# Altium project h616_v1_0.PrjPcb
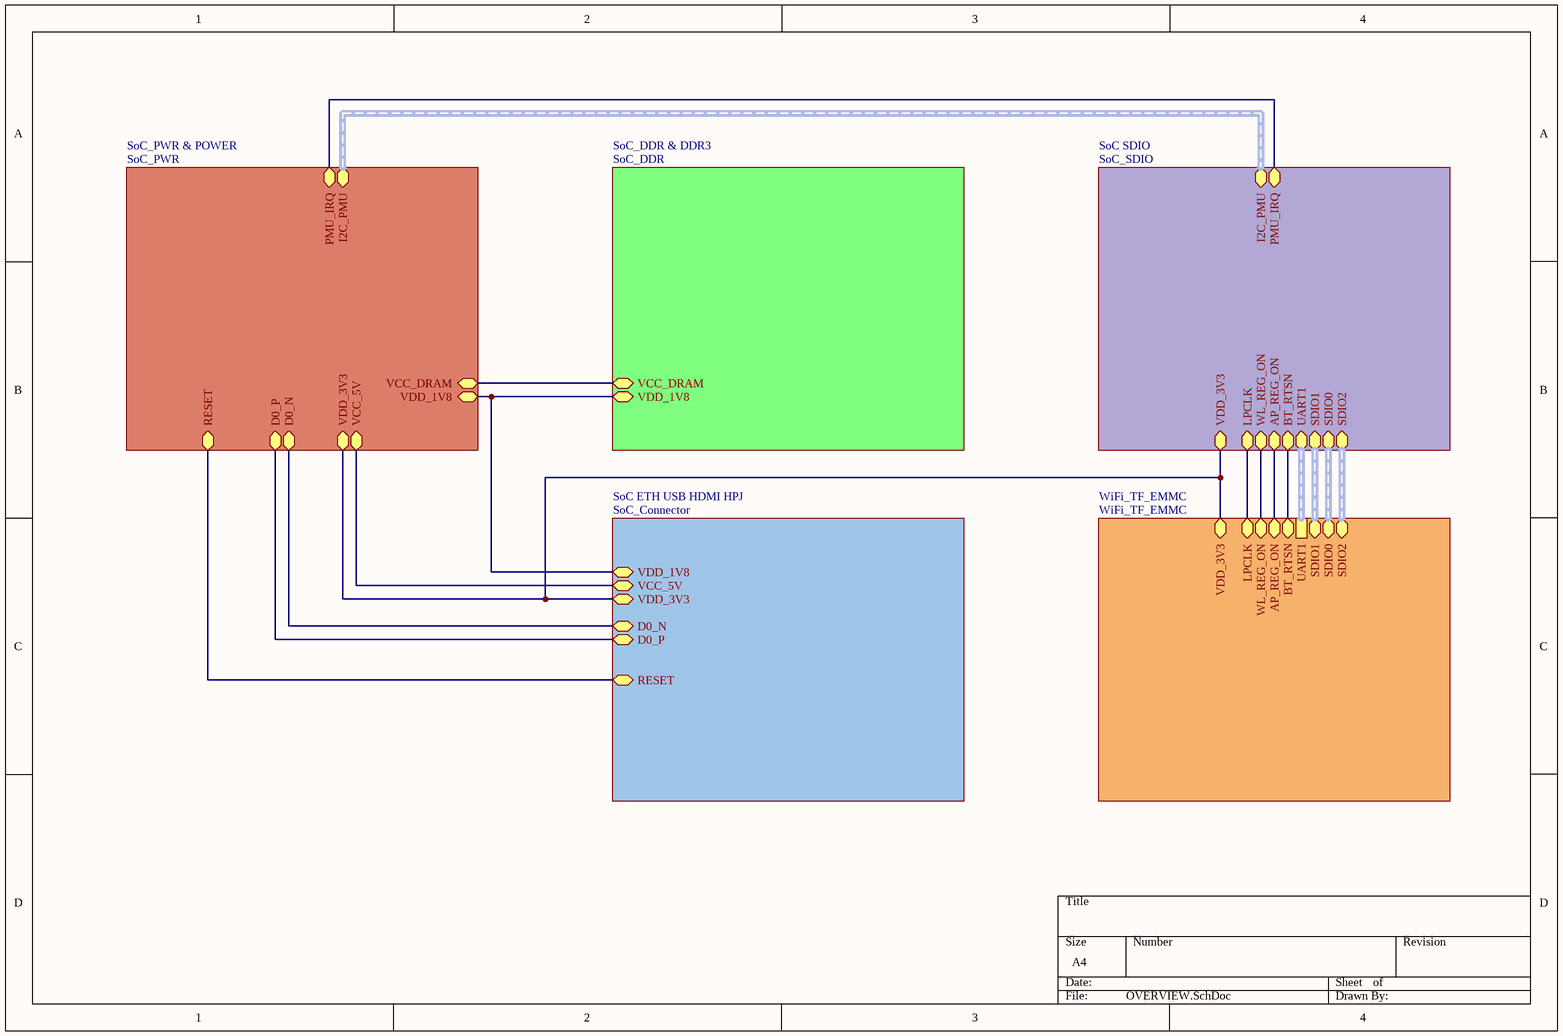
[diagram p0: OVERVIEW.SchDoc]
6 sheets, 145 parts. Net scope: hierarchical (ports join the sheet entries above them; power ports are global).
Board file: H616_PCB.PcbDoc
Sheets:
  OVERVIEW.SchDoc
    SoC_DDR & DDR3 = SoC_DDR.SchDoc
    SoC_PWR & POWER = SoC_PWR.SchDoc
    SoC ETH USB HDMI HPJ = SoC_Connector.SchDoc
    SoC SDIO = SoC_SDIO.SchDoc
    WiFi_TF_EMMC = WiFi_TF_EMMC.SchDoc

## Sheet OVERVIEW.SchDoc
size A4; SheetNumber: 1; SheetTotal: 6

### Sub-sheets
SoC ETH USB HDMI HPJ = SoC_Connector: VCC_5V (bidir), VDD_3V3 (bidir), VDD_1V8 (bidir), D0_N (bidir), D0_P (bidir), RESET (bidir)
SoC SDIO = SoC_SDIO: VDD_3V3 (bidir), LPCLK (bidir), WL_REG_ON (bidir), AP_REG_ON (bidir), BT_RTSN (bidir), UART1 (bidir), SDIO1 (bidir), SDIO0 (bidir), I2C_PMU (bidir), PMU_IRQ (bidir), SDIO2 (bidir)
SoC_DDR & DDR3 = SoC_DDR: VCC_DRAM (bidir), VDD_1V8 (bidir)
SoC_PWR & POWER = SoC_PWR: VCC_DRAM (bidir), VDD_1V8 (bidir), VCC_5V (bidir), VDD_3V3 (bidir), D0_P (bidir), D0_N (bidir), I2C_PMU (bidir), RESET (bidir), PMU_IRQ (bidir)
WiFi_TF_EMMC = WiFi_TF_EMMC: LPCLK (bidir), WL_REG_ON (bidir), AP_REG_ON (bidir), BT_RTSN (bidir), UART1, SDIO1 (bidir), VDD_3V3 (bidir), SDIO0 (bidir), SDIO2 (bidir)

### Nets
VCC_5V: sheet SoC_PWR & POWER/VCC_5V, sheet SoC ETH USB HDMI HPJ/VCC_5V
VCC_DRAM: sheet SoC_DDR & DDR3/VCC_DRAM, sheet SoC_PWR & POWER/VCC_DRAM
VDD_1V8: sheet SoC_DDR & DDR3/VDD_1V8, sheet SoC_PWR & POWER/VDD_1V8, sheet SoC ETH USB HDMI HPJ/VDD_1V8
VDD_3V3: sheet SoC_PWR & POWER/VDD_3V3, sheet SoC ETH USB HDMI HPJ/VDD_3V3, sheet SoC SDIO/VDD_3V3, sheet WiFi_TF_EMMC/VDD_3V3
AP_REG_ON: sheet SoC SDIO/AP_REG_ON, sheet WiFi_TF_EMMC/AP_REG_ON
BT_RTSN: sheet SoC SDIO/BT_RTSN, sheet WiFi_TF_EMMC/BT_RTSN
D0_N: sheet SoC_PWR & POWER/D0_N, sheet SoC ETH USB HDMI HPJ/D0_N
D0_P: sheet SoC_PWR & POWER/D0_P, sheet SoC ETH USB HDMI HPJ/D0_P
LPCLK: sheet SoC SDIO/LPCLK, sheet WiFi_TF_EMMC/LPCLK
PMU_IRQ: sheet SoC_PWR & POWER/PMU_IRQ, sheet SoC SDIO/PMU_IRQ
RESET: sheet SoC_PWR & POWER/RESET, sheet SoC ETH USB HDMI HPJ/RESET
WL_REG_ON: sheet SoC SDIO/WL_REG_ON, sheet WiFi_TF_EMMC/WL_REG_ON

### Buses and harness runs
harness sheet SoC SDIO/I2C_PMU = sheet SoC_PWR & POWER/I2C_PMU
harness sheet SoC SDIO/SDIO0 = sheet WiFi_TF_EMMC/SDIO0
harness sheet SoC SDIO/SDIO1 = sheet WiFi_TF_EMMC/SDIO1
harness sheet SoC SDIO/SDIO2 = sheet WiFi_TF_EMMC/SDIO2
harness sheet SoC SDIO/UART1 = sheet WiFi_TF_EMMC/UART1

## Sheet SoC_DDR.SchDoc
size A3; SheetNumber: 2; SheetTotal: 6
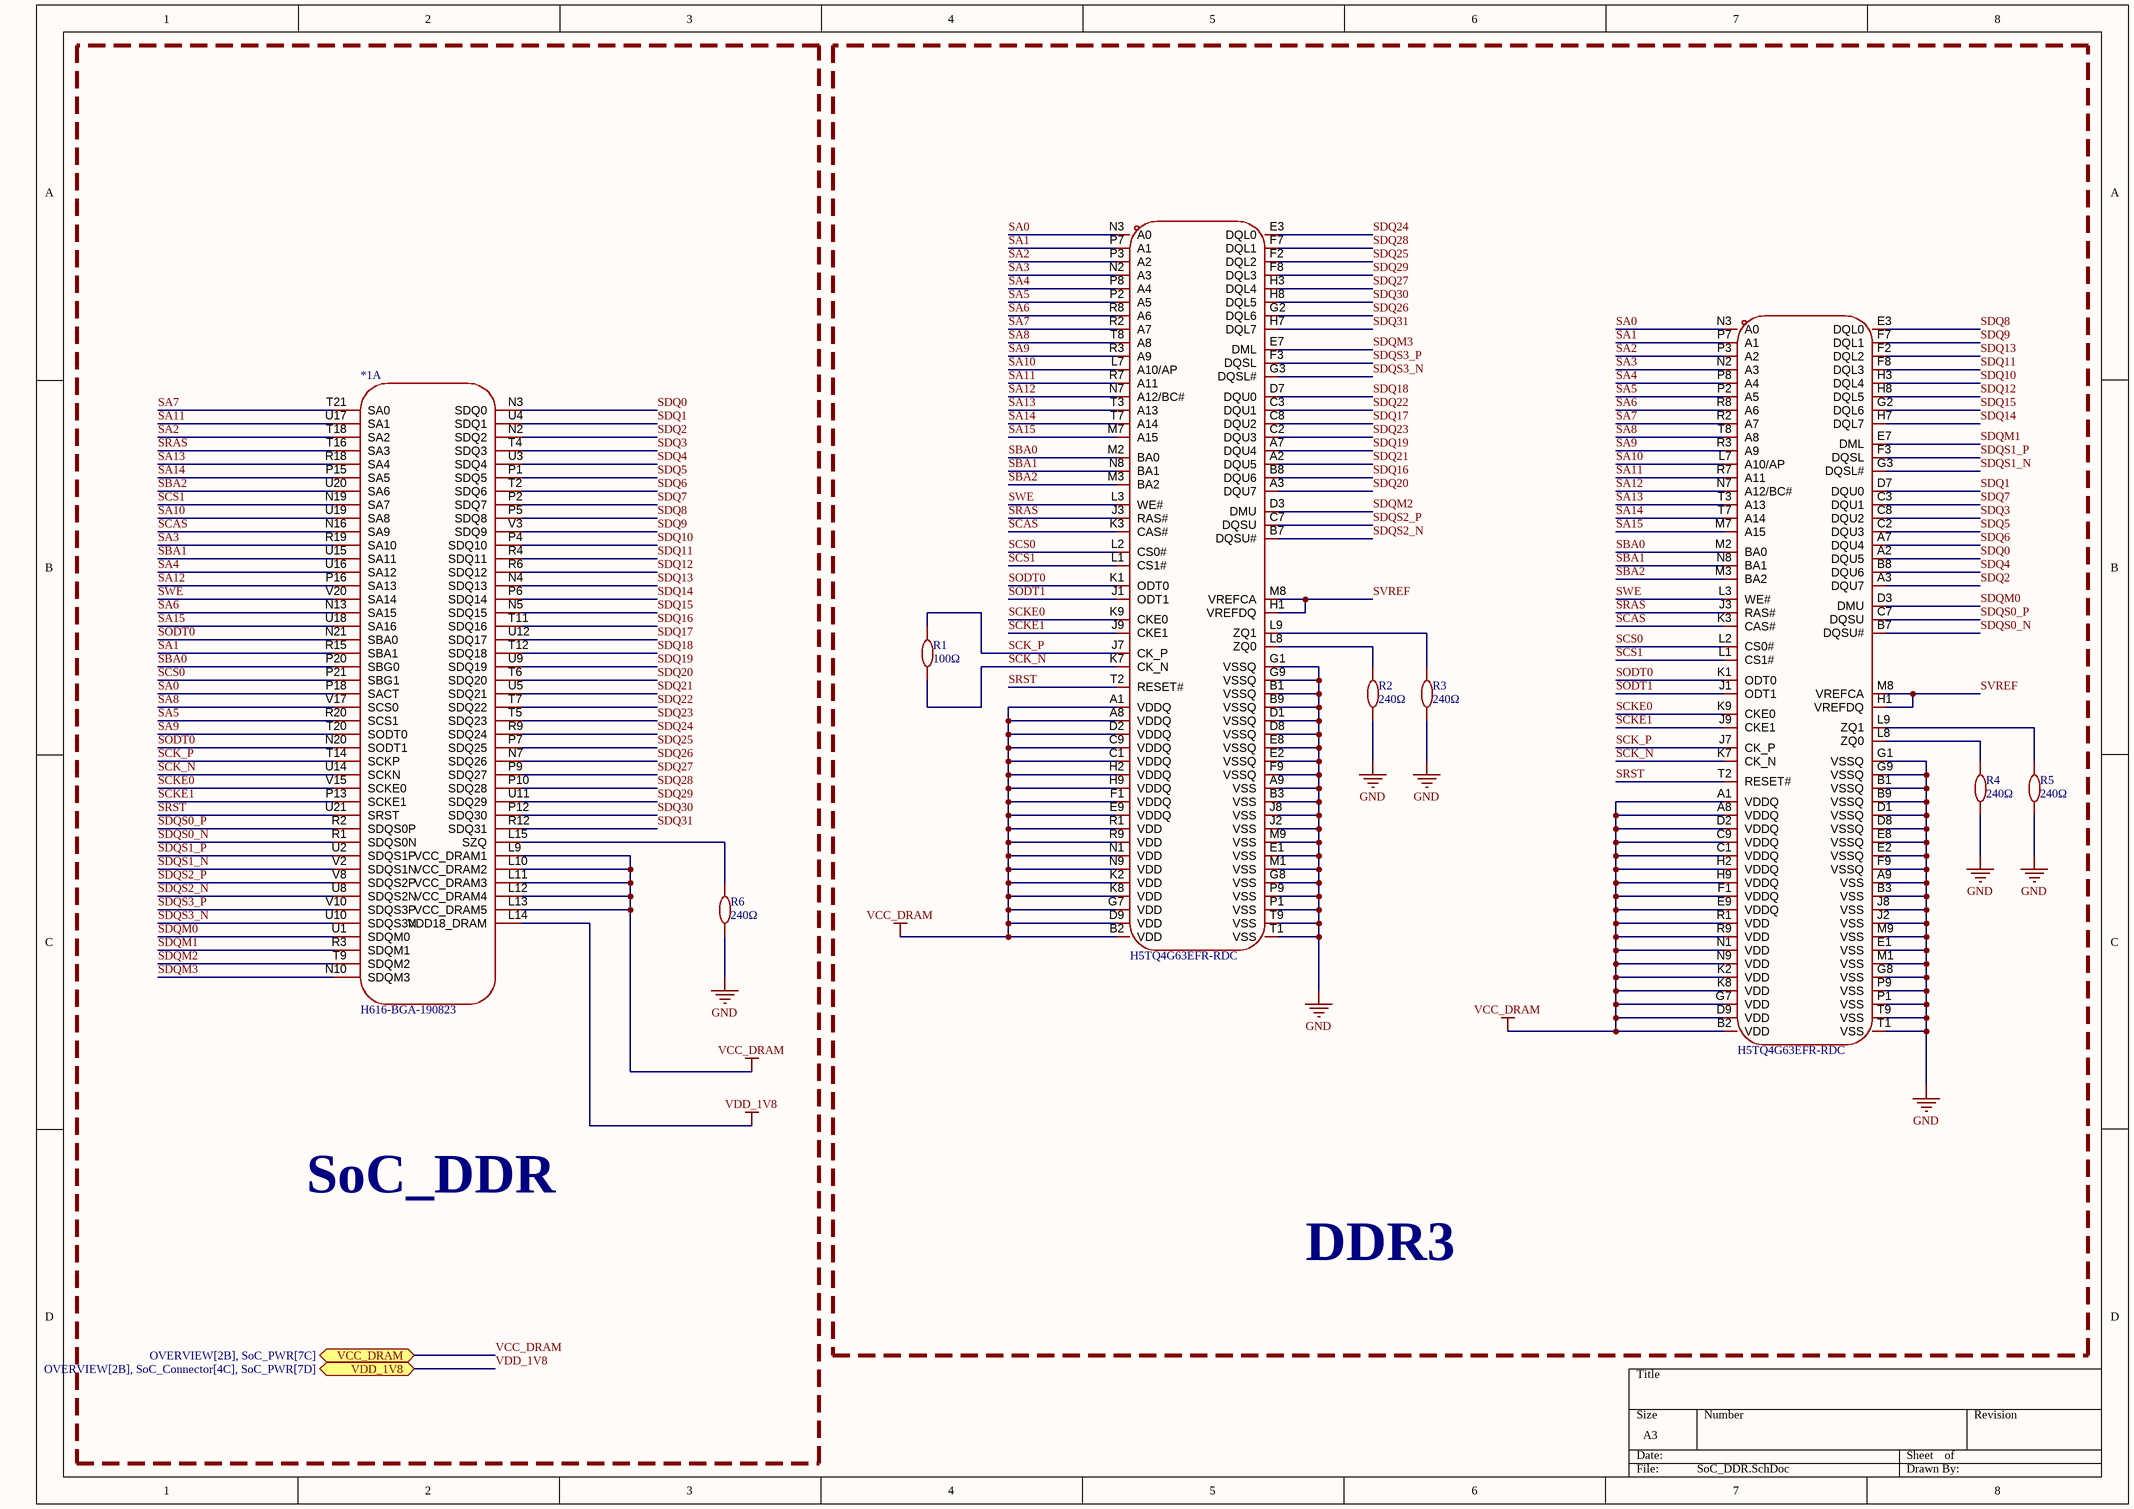
[diagram p1: SoC_DDR.SchDoc]

### Parts
*1  H616-BGA-190823  [BGA-284_L14.0-W12.0-P0.65-TL]  (part A of 4)
R1  100Ω  [R0402]
R2  240Ω  [R0402]
R3  240Ω  [R0402]
R4  240Ω  [R0402]
R5  240Ω  [R0402]
R6  240Ω  [R0402]
U1  H5TQ4G63EFR-RDC  [TFBGA-96_L13.0-W7.5-R16-C6-P0.80-TL]
U2  H5TQ4G63EFR-RDC  [TFBGA-96_L13.0-W7.5-R16-C6-P0.80-TL]

### Blocks framed on the sheet
SoC_DDR: *1 R6
DDR3: R1-R5 U1 U2

### Ports
VCC_DRAM (bidir, see OVERVIEW[2B], SoC_PWR[7C]), VDD_1V8 (bidir, see OVERVIEW[2B], SoC_Connector[4C], SoC_PWR[7D])

### Nets
GND: R2.1 R3.1 R4.1 R5.1 R6.1 U1.A9(VSS) U1.B1(VSSQ) U1.B3(VSS) U1.B9(VSSQ) U1.D1(VSSQ) U1.D8(VSSQ) U1.E1(VSS) U1.E2(VSSQ) U1.E8(VSSQ) U1.F9(VSSQ) U1.G1(VSSQ) U1.G8(VSS) U1.G9(VSSQ) U1.J2(VSS) U1.J8(VSS) U1.M1(VSS) U1.M9(VSS) U1.P1(VSS) U1.P9(VSS) U1.T1(VSS) U1.T9(VSS) U2.A9(VSS) U2.B1(VSSQ) U2.B3(VSS) U2.B9(VSSQ) U2.D1(VSSQ) U2.D8(VSSQ) U2.E1(VSS) U2.E2(VSSQ) U2.E8(VSSQ) U2.F9(VSSQ) U2.G1(VSSQ) U2.G8(VSS) U2.G9(VSSQ) U2.J2(VSS) U2.J8(VSS) U2.M1(VSS) U2.M9(VSS) U2.P1(VSS) U2.P9(VSS) U2.T1(VSS) U2.T9(VSS)
VCC_DRAM: *1.L9(VCC_DRAM1) *1.L10(VCC_DRAM2) *1.L11(VCC_DRAM3) *1.L12(VCC_DRAM4) *1.L13(VCC_DRAM5) U1.A1(VDDQ) U1.A8(VDDQ) U1.B2(VDD) U1.C1(VDDQ) U1.C9(VDDQ) U1.D2(VDDQ) U1.D9(VDD) U1.E9(VDDQ) U1.F1(VDDQ) U1.G7(VDD) U1.H2(VDDQ) U1.H9(VDDQ) U1.K2(VDD) U1.K8(VDD) U1.N1(VDD) U1.N9(VDD) U1.R1(VDD) U1.R9(VDD) U2.A1(VDDQ) U2.A8(VDDQ) U2.B2(VDD) U2.C1(VDDQ) U2.C9(VDDQ) U2.D2(VDDQ) U2.D9(VDD) U2.E9(VDDQ) U2.F1(VDDQ) U2.G7(VDD) U2.H2(VDDQ) U2.H9(VDDQ) U2.K2(VDD) U2.K8(VDD) U2.N1(VDD) U2.N9(VDD) U2.R1(VDD) U2.R9(VDD) ; port VCC_DRAM
VDD_1V8: *1.L14(VDD18_DRAM) ; port VDD_1V8
SA0: *1.P18(SACT) U1.N3(A0) U2.N3(A0)
SA1: *1.R15(SBA1) U1.P7(A1) U2.P7(A1)
SA2: *1.T18(SA2) U1.P3(A2) U2.P3(A2)
SA3: *1.R19(SA10) U1.N2(A3) U2.N2(A3)
SA4: *1.U16(SA12) U1.P8(A4) U2.P8(A4)
SA5: *1.R20(SCS1) U1.P2(A5) U2.P2(A5)
SA6: *1.N13(SA15) U1.R8(A6) U2.R8(A6)
SA7: *1.T21(SA0) U1.R2(A7) U2.R2(A7)
SA8: *1.V17(SCS0) U1.T8(A8) U2.T8(A8)
SA9: *1.T20(SODT0) U1.R3(A9) U2.R3(A9)
SA10: *1.U19(SA8) U1.L7(A10/AP) U2.L7(A10/AP)
SA11: *1.U17(SA1) U1.R7(A11) U2.R7(A11)
SA12: *1.P16(SA13) U1.N7(A12/BC#) U2.N7(A12/BC#)
SA13: *1.R18(SA4) U1.T3(A13) U2.T3(A13)
SA14: *1.P15(SA5) U1.T7(A14) U2.T7(A14)
SA15: *1.U18(SA16) U1.M7(A15) U2.M7(A15)
SBA0: *1.P20(SBG0) U1.M2(BA0) U2.M2(BA0)
SBA1: *1.U15(SA11) U1.N8(BA1) U2.N8(BA1)
SBA2: *1.U20(SA6) U1.M3(BA2) U2.M3(BA2)
SCAS: *1.N16(SA9) U1.K3(CAS#) U2.K3(CAS#)
SCK_N: *1.U14(SCKN) R1.1 U1.K7(CK_N) U2.K7(CK_N)
SCK_P: *1.T14(SCKP) R1.2 U1.J7(CK_P) U2.J7(CK_P)
SCKE0: *1.V15(SCKE0) U1.K9(CKE0) U2.K9(CKE0)
SCKE1: *1.P13(SCKE1) U1.J9(CKE1) U2.J9(CKE1)
SCS0: *1.P21(SBG1) U1.L2(CS0#) U2.L2(CS0#)
SCS1: *1.N19(SA7) U1.L1(CS1#) U2.L1(CS1#)
SDQ0: *1.N3(SDQ0) U2.A2(DQU5)
SDQ1: *1.U4(SDQ1) U2.D7(DQU0)
SDQ2: *1.N2(SDQ2) U2.A3(DQU7)
SDQ3: *1.T4(SDQ3) U2.C8(DQU2)
SDQ4: *1.U3(SDQ4) U2.B8(DQU6)
SDQ5: *1.P1(SDQ5) U2.C2(DQU3)
SDQ6: *1.T2(SDQ6) U2.A7(DQU4)
SDQ7: *1.P2(SDQ7) U2.C3(DQU1)
SDQ8: *1.P5(SDQ8) U2.E3(DQL0)
SDQ9: *1.V3(SDQ9) U2.F7(DQL1)
SDQ10: *1.P4(SDQ10) U2.H3(DQL4)
SDQ11: *1.R4(SDQ11) U2.F8(DQL3)
SDQ12: *1.R6(SDQ12) U2.H8(DQL5)
SDQ13: *1.N4(SDQ13) U2.F2(DQL2)
SDQ14: *1.P6(SDQ14) U2.H7(DQL7)
SDQ15: *1.N5(SDQ15) U2.G2(DQL6)
SDQ16: *1.T11(SDQ16) U1.B8(DQU6)
SDQ17: *1.U12(SDQ17) U1.C8(DQU2)
SDQ18: *1.T12(SDQ18) U1.D7(DQU0)
SDQ19: *1.U9(SDQ19) U1.A7(DQU4)
SDQ20: *1.T6(SDQ20) U1.A3(DQU7)
SDQ21: *1.U5(SDQ21) U1.A2(DQU5)
SDQ22: *1.T7(SDQ22) U1.C3(DQU1)
SDQ23: *1.T5(SDQ23) U1.C2(DQU3)
SDQ24: *1.R9(SDQ24) U1.E3(DQL0)
SDQ25: *1.P7(SDQ25) U1.F2(DQL2)
SDQ26: *1.N7(SDQ26) U1.G2(DQL6)
SDQ27: *1.P9(SDQ27) U1.H3(DQL4)
SDQ28: *1.P10(SDQ28) U1.F7(DQL1)
SDQ29: *1.U11(SDQ29) U1.F8(DQL3)
SDQ30: *1.P12(SDQ30) U1.H8(DQL5)
SDQ31: *1.R12(SDQ31) U1.H7(DQL7)
SDQM0: *1.U1(SDQM0) U2.D3(DMU)
SDQM1: *1.R3(SDQM1) U2.E7(DML)
SDQM2: *1.T9(SDQM2) U1.D3(DMU)
SDQM3: *1.N10(SDQM3) U1.E7(DML)
SDQS0_N: *1.R1(SDQS0N) U2.B7(DQSU#)
SDQS0_P: *1.R2(SDQS0P) U2.C7(DQSU)
SDQS1_N: *1.V2(SDQS1N) U2.G3(DQSL#)
SDQS1_P: *1.U2(SDQS1P) U2.F3(DQSL)
SDQS2_N: *1.U8(SDQS2N) U1.B7(DQSU#)
SDQS2_P: *1.V8(SDQS2P) U1.C7(DQSU)
SDQS3_N: *1.U10(SDQS3N) U1.G3(DQSL#)
SDQS3_P: *1.V10(SDQS3P) U1.F3(DQSL)
SODT0: *1.N20(SODT1) *1.N21(SBA0) U1.K1(ODT0) U2.K1(ODT0)
SODT1: U1.J1(ODT1) U2.J1(ODT1)
SRAS: *1.T16(SA3) U1.J3(RAS#) U2.J3(RAS#)
SRST: *1.U21(SRST) U1.T2(RESET#) U2.T2(RESET#)
SVREF: U1.H1(VREFDQ) U1.M8(VREFCA) U2.H1(VREFDQ) U2.M8(VREFCA)
SWE: *1.V20(SA14) U1.L3(WE#) U2.L3(WE#)
Net*1_L15: *1.L15(SZQ) R6.2
NetR2_2: R2.2 U1.L8(ZQ0)
NetR3_2: R3.2 U1.L9(ZQ1)
NetR4_2: R4.2 U2.L8(ZQ0)
NetR5_2: R5.2 U2.L9(ZQ1)

### Library data of the parts
*1 = H616-BGA-190823: Allwinner H616; Symbol: H616-BGA-190823
R1 = 100Ω: 100Ω 62.5mW 50V ±100ppm/℃ Thick Film Resistor ±1% 0402 Chip Resistor - Surface Mount ROHS
R2-R6 = 240Ω: 240Ω 62.5mW 50V ±100ppm/℃ Thick Film Resistor ±1% 0402 Chip Resistor - Surface Mount ROHS
U1 U2 = H5TQ4G63EFR-RDC: 4Gb DDR3 同步动态随机存取存储器; Symbol: H5TQ4G63EFR-RDC

## Sheet SoC_PWR.SchDoc
size A3; SheetNumber: 3; SheetTotal: 6
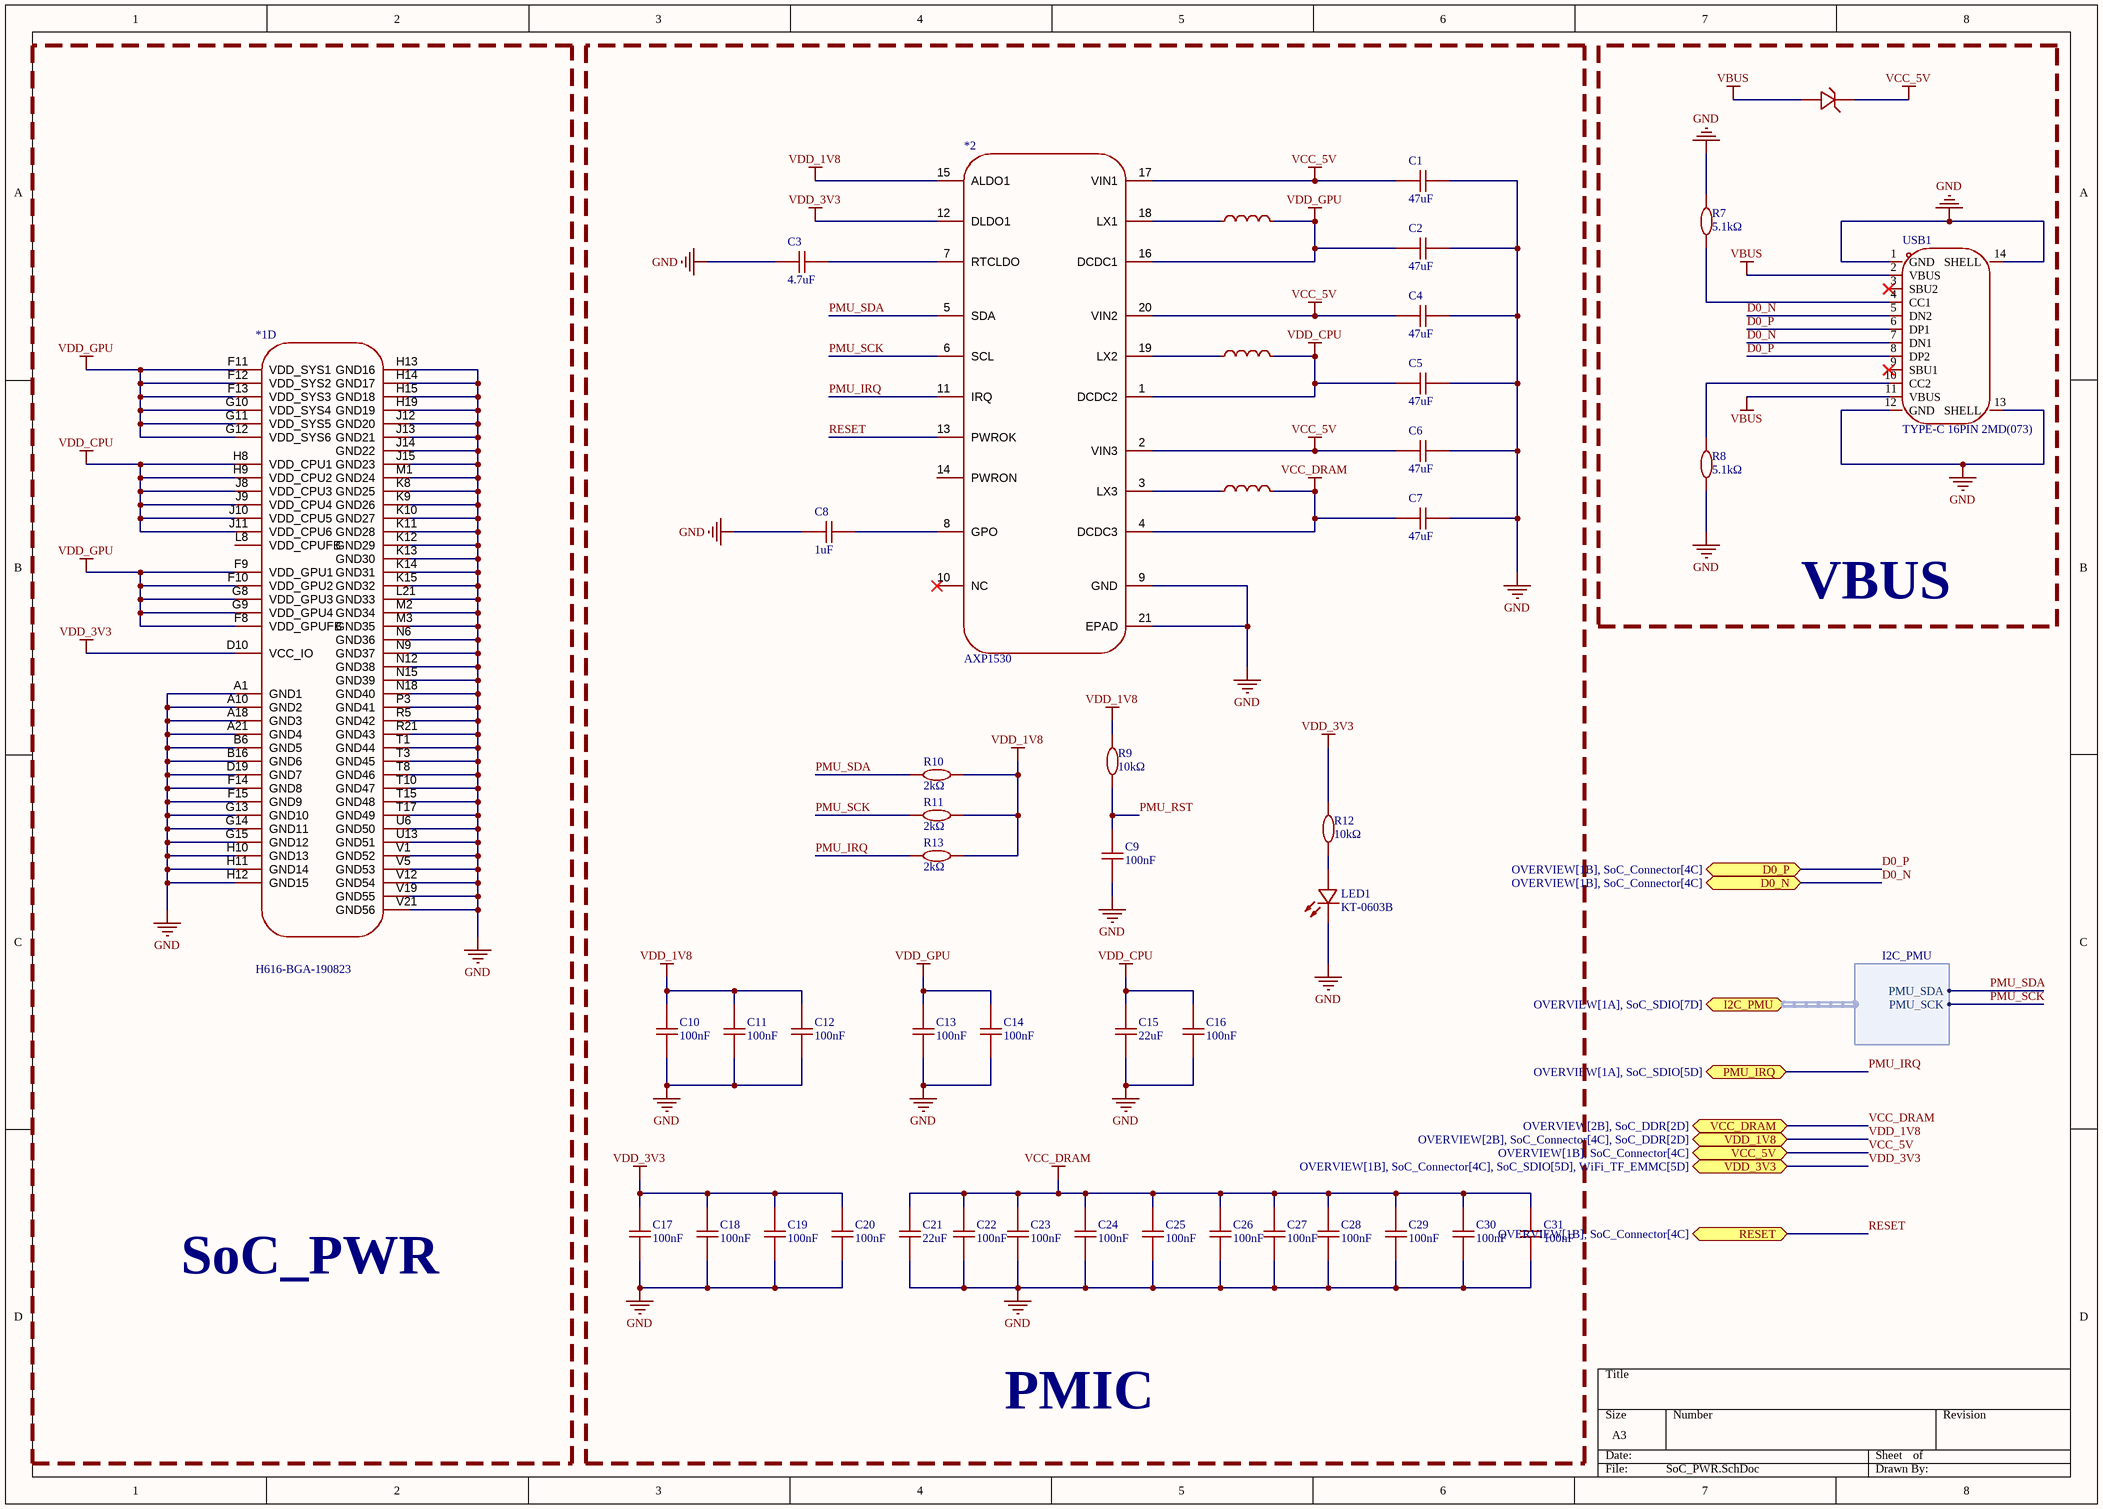
[diagram p2: SoC_PWR.SchDoc]

### Parts
*1  H616-BGA-190823  [BGA-284_L14.0-W12.0-P0.65-TL]  (part D of 4)
*2  AXP1530  [QFN-20_L3.0-W3.0-P0.40-BL-EP1.7]
C1  47uF  [C0603]
C2  47uF  [C0603]
C3  4.7uF  [C0402]
C4  47uF  [C0603]
C5  47uF  [C0603]
C6  47uF  [C0603]
C7  47uF  [C0603]
C8  1uF  [C0402]
C9  100nF  [C0402]
C10  100nF  [C0402]
C11  100nF  [C0402]
C12  100nF  [C0402]
C13  100nF  [C0402]
C14  100nF  [C0402]
C15  22uF  [C0603]
C16  100nF  [C0402]
C17  100nF  [C0402]
C18  100nF  [C0402]
C19  100nF  [C0402]
C20  100nF  [C0402]
C21  22uF  [C0603]
C22  100nF  [C0402]
C23  100nF  [C0402]
C24  100nF  [C0402]
C25  100nF  [C0402]
C26  100nF  [C0402]
C27  100nF  [C0402]
C28  100nF  [C0402]
C29  100nF  [C0402]
C30  100nF  [C0402]
C31  100nF  [C0402]
D1  DSK24  [SOD-123FL_L2.7-W1.8-LS3.8-RD]  (value not drawn)
L1  1uH  [IND-SMD_L4.0-W4.0]  (value not drawn)
L2  1uH  [IND-SMD_L4.0-W4.0]  (value not drawn)
L3  1uH  [IND-SMD_L4.0-W4.0]  (value not drawn)
LED1  KT-0603B  [LED0603-BL]
R7  5.1kΩ  [R0402]
R8  5.1kΩ  [R0402]
R9  10kΩ  [R0402]
R10  2kΩ  [R0402]
R11  2kΩ  [R0402]
R12  10kΩ  [R0402]
R13  2kΩ  [R0402]
USB1  TYPE-C 16PIN 2MD(073)  [USB-C-SMD_TYPE-C-6PIN-2MD-073]

### Blocks framed on the sheet
SoC_PWR: *1
PMIC: *2 C1-C31 L1-L3 LED1 R9-R13
VBUS: D1 R7 R8 USB1

### Ports
D0_N (bidir, see OVERVIEW[1B], SoC_Connector[4C]), D0_P (bidir, see OVERVIEW[1B], SoC_Connector[4C]), I2C_PMU (bidir, harness I2C_PMU, see OVERVIEW[1A], SoC_SDIO[7D]), PMU_IRQ (bidir, see OVERVIEW[1A], SoC_SDIO[5D]), RESET (bidir, see OVERVIEW[1B], SoC_Connector[4C]), VCC_5V (bidir, see OVERVIEW[1B], SoC_Connector[4C]), VCC_DRAM (bidir, see OVERVIEW[2B], SoC_DDR[2D]), VDD_1V8 (bidir, see OVERVIEW[2B], SoC_Connector[4C], SoC_DDR[2D]), VDD_3V3 (bidir, see OVERVIEW[1B], SoC_Connector[4C], SoC_SDIO[5D], WiFi_TF_EMMC[5D])

### Harnesses
I2C_PMU: PMU_SDA, PMU_SCK

### Nets
GND: *1.A1(GND1) *1.A10(GND2) *1.A18(GND3) *1.A21(GND4) *1.B6(GND5) *1.B16(GND6) *1.D19(GND7) *1.F14(GND8) *1.F15(GND9) *1.G13(GND10) *1.G14(GND11) *1.G15(GND12) *1.H10(GND13) *1.H11(GND14) *1.H12(GND15) *1.H13(GND16) *1.H14(GND17) *1.H15(GND18) *1.H19(GND19) *1.J12(GND20) *1.J13(GND21) *1.J14(GND22) *1.J15(GND23) *1.K8(GND25) *1.K9(GND26) *1.K10(GND27) *1.K11(GND28) *1.K12(GND29) *1.K13(GND30) *1.K14(GND31) *1.K15(GND32) *1.L21(GND33) *1.M1(GND24) *1.M2(GND34) *1.M3(GND35) *1.N6(GND36) *1.N9(GND37) *1.N12(GND38) *1.N15(GND39) *1.N18(GND40) *1.P3(GND41) *1.R5(GND42) *1.R21(GND43) *1.T1(GND44) *1.T3(GND45) *1.T8(GND46) *1.T10(GND47) *1.T15(GND48) *1.T17(GND49) *1.U6(GND50) *1.U13(GND51) *1.V1(GND52) *1.V5(GND53) *1.V12(GND54) *1.V19(GND55) *1.V21(GND56) *2.9(GND) *2.21(EPAD) C1.2 C2.2 C3.1 C4.2 C5.2 C6.2 C7.2 C8.1 C9.1 C10.1 C11.1 C12.1 C13.1 C14.1 C15.1 C16.1 C17.1 C18.1 C19.1 C20.1 C21.1 C22.1 C23.1 C24.1 C25.1 C26.1 C27.1 C28.1 C29.1 C30.1 C31.1 LED1.1(K) R7.2 R8.2 USB1.1(GND) USB1.12(GND) USB1.13(SHELL) USB1.14(SHELL)
VBUS: D1.2(A) USB1.2(VBUS) USB1.11(VBUS)
VCC_5V: *2.2(VIN3) *2.17(VIN1) *2.20(VIN2) C1.1 C4.1 C6.1 D1.1(C) ; port VCC_5V
VCC_DRAM: *2.4(DCDC3) C7.1 C21.2 C22.2 C23.2 C24.2 C25.2 C26.2 C27.2 C28.2 C29.2 C30.2 C31.2 L3.2 ; port VCC_DRAM
VDD_1V8: *2.15(ALDO1) C10.2 C11.2 C12.2 R9.2 R10.2 R11.2 R13.2 ; port VDD_1V8
VDD_3V3: *1.D10(VCC_IO) *2.12(DLDO1) C17.2 C18.2 C19.2 C20.2 R12.2 ; port VDD_3V3
VDD_CPU: *1.H8(VDD_CPU1) *1.H9(VDD_CPU2) *1.J8(VDD_CPU3) *1.J9(VDD_CPU4) *1.J10(VDD_CPU5) *1.J11(VDD_CPU6) *2.1(DCDC2) C5.1 C15.2 C16.2 L2.2
VDD_GPU: *1.F8(VDD_GPUFB) *1.F9(VDD_GPU1) *1.F10(VDD_GPU2) *1.F11(VDD_SYS1) *1.F12(VDD_SYS2) *1.F13(VDD_SYS3) *1.G8(VDD_GPU3) *1.G9(VDD_GPU4) *1.G10(VDD_SYS4) *1.G11(VDD_SYS5) *1.G12(VDD_SYS6) *2.16(DCDC1) C2.1 C13.2 C14.2 L1.2
D0_N: USB1.5(DN2) USB1.7(DN1) ; port D0_N
D0_P: USB1.6(DP1) USB1.8(DP2) ; port D0_P
PMU_IRQ: *2.11(IRQ) R13.1 ; port PMU_IRQ
PMU_RST: C9.2 R9.1
PMU_SCK: *2.6(SCL) R11.1 ; port I2C_PMU.PMU_SCK
PMU_SDA: *2.5(SDA) R10.1 ; port I2C_PMU.PMU_SDA
RESET: *2.13(PWROK) ; port RESET
Net*2_3: *2.3(LX3) L3.1
Net*2_7: *2.7(RTCLDO) C3.2
Net*2_8: *2.8(GPO) C8.2
Net*2_18: *2.18(LX1) L1.1
Net*2_19: *2.19(LX2) L2.1
NetLED1_2: LED1.2(A) R12.1
NetR7_1: R7.1 USB1.4(CC1)
NetR8_1: R8.1 USB1.10(CC2)

Not connected (* = marked no-connect by the designer): *1 L8(VDD_CPUFB); *2 10(NC)* 14(PWRON); USB1 3(SBU2)* 9(SBU1)*

### Library data of the parts
*1 = H616-BGA-190823: Allwinner H616; Symbol: H616-BGA-190823
*2 = AXP1530: AXP313A; Symbol: AXP1530
C1 C2 C4-C7 = 47uF: 16V 22uF X5R ±20% 0603 Ceramic Capacitors ROHS
C3 = 4.7uF: 10V 4.7uF X5R ±20% 0402 Ceramic Capacitors ROHS
C8 = 1uF: 50V 1uF X5R ±10% 0402 Ceramic Capacitors ROHS
C9-C14 C16-C20 C22-C31 = 100nF: 50V 100nF X7R ±10% 0402 Ceramic Capacitors ROHS
C15 C21 = 22uF: 16V 22uF X5R ±20% 0603 Ceramic Capacitors ROHS
D1 = DSK24: 电压:40V 电流:2A; Manufacturer: Littelfuse(美国力特); Manufacturer Part: SMAJ5.0A; Symbol: SMAJ5.0A-C83329; Device: SMAJ5.0A_C83329; Add into BOM: yes; Polarity: Unidirectional; Reverse Stand-Off Voltage (Vrwm): 5V; Clamping Voltage: 9.2V; Peak Pulse Current (Ipp): 43.5A; Peak Pulse Power Dissipation (Ppp): 400W; Voltage - Breakdown: 6.4V; Reverse Leakage Current (Ir): 800uA; Type: TVS; LCSC Part Name: 耐压/V 5V-440V 峰值脉冲功率 400W; Supplier Part: C83329; Supplier Footprint: DO-214AC(SMA); JLCPCB Part Class: Extended Part; Datasheet: https://item.szlcsc.com/datasheet/SMAJ5.0A/84493.html; Supplier: LCSC; Convert to PCB: yes; Operating Temperature: -65℃~+150℃
L1-L3 = SLW4030S1R0NST: 4.15A 1uH ±30% 18mΩ SMD,4x4mm Fixed Inductors ROHS; Manufacturer: Sunltech(顺磁); Add into BOM: yes; Symbol: SLW4030S1R0NST; Device: SLW4030S1R0NST; LCSC Part Name: 1uH ±30%; Supplier Part: C206354; Manufacturer Part: SLW4030S1R0NST; Supplier Footprint: SMD,4x4mm; JLCPCB Part Class: Extended Part; Datasheet: https://item.szlcsc.com/datasheet/SLW4030S1R0NST/207399.html; Supplier: LCSC; Convert to PCB: yes; Value: 1uH; Tolerance: ±30%; Current Rating: 4.15A; DC Resistance(DCR): 18mΩ
LED1 = KT-0603B: 30mA 2.6V~3.2V Blue 0603 LED Indication - Discrete ROHS
R7 R8 = 5.1kΩ: 5.1kΩ 62.5mW 50V ±100ppm/℃ Thick Film Resistor ±1% 0402 Chip Resistor - Surface Mount ROHS
R9 R12 = 10kΩ: 62.5mW 10kΩ 50V ±100ppm/℃ Thick Film Resistor ±1% 0402 Chip Resistor - Surface Mount ROHS
R10 R11 R13 = 2kΩ: 100mW 2kΩ 75V ±100ppm/℃ Thick Film Resistor ±1% 0402 Chip Resistor - Surface Mount ROHS
USB1 = TYPE-C 16PIN 2MD(073): 16pin type-c

## Sheet SoC_Connector.SchDoc
size A3; SheetNumber: 4; SheetTotal: 6
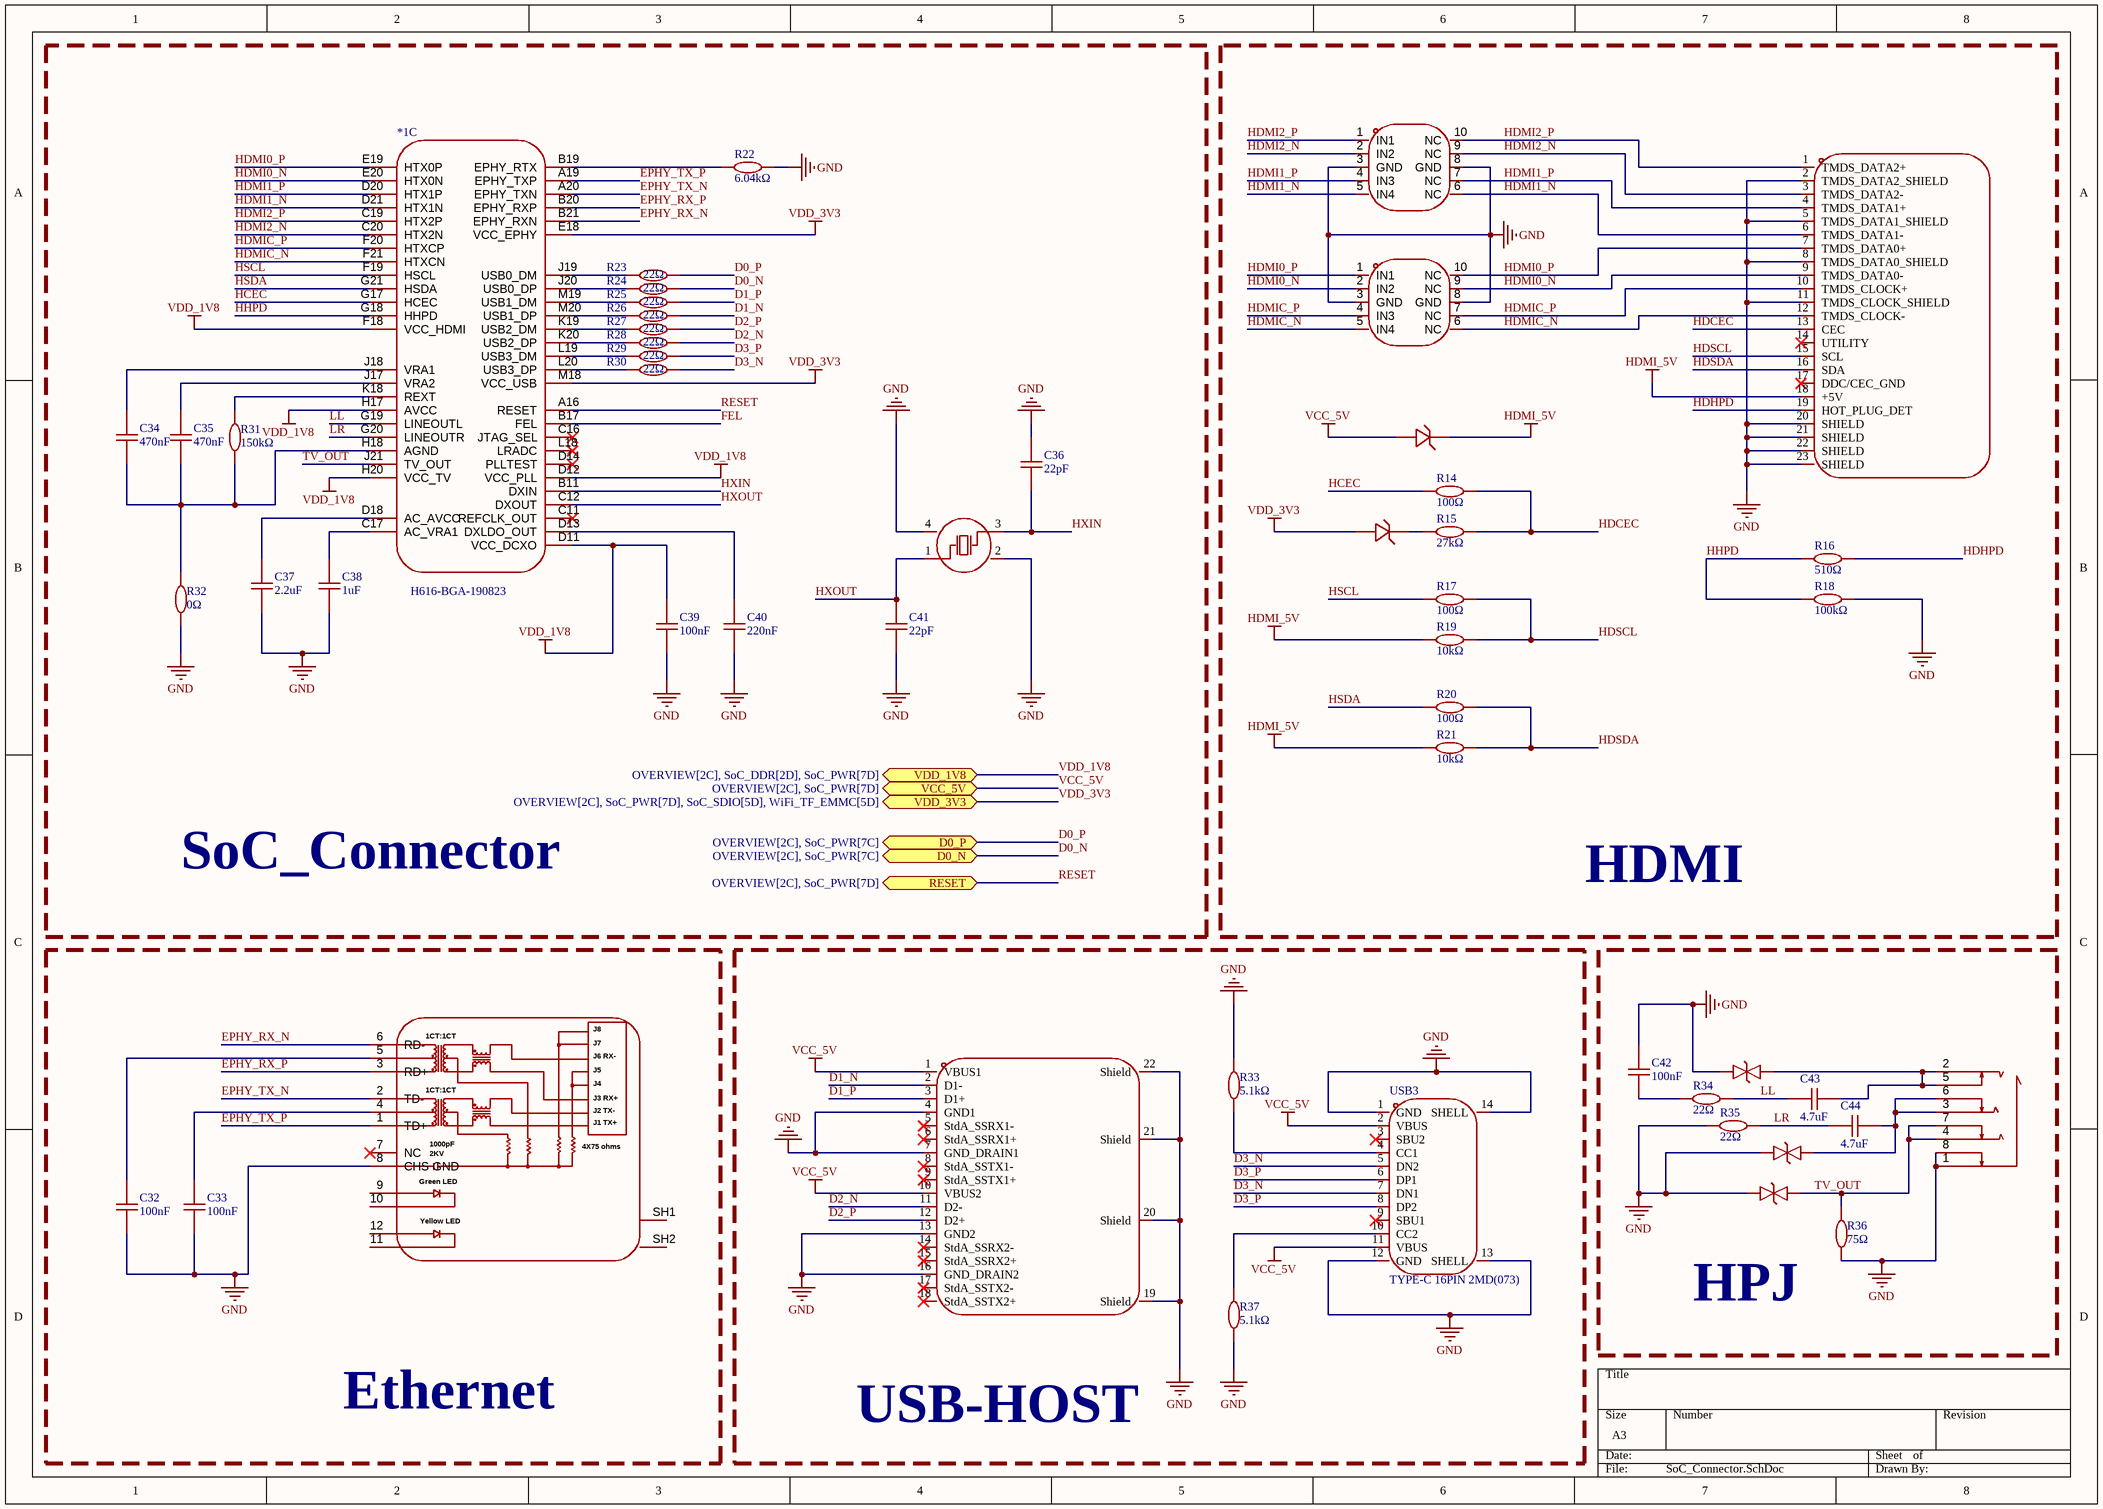
[diagram p3: SoC_Connector.SchDoc]

### Parts
*1  H616-BGA-190823  [BGA-284_L14.0-W12.0-P0.65-TL]  (part C of 4)
AUDIO1  PJ-3930-8A  [AUDIO-TH_PJ-3930-8A]  (value not drawn)
C32  100nF  [C0402]
C33  100nF  [C0402]
C34  470nF  [C0402]
C35  470nF  [C0402]
C36  22pF  [C0402]
C37  2.2uF  [C0402]
C38  1uF  [C0402]
C39  100nF  [C0402]
C40  220nF  [C0402]
C41  22pF  [C0402]
C42  100nF  [C0402]
C43  4.7uF  [C0402]
C44  4.7uF  [C0402]
CN1  KH-HDMI-19P-Cu  [HDMI-SMD_KH-HDMI-19P-CU]  (value not drawn)
D2  RClamp0524PATCT  [SLP2510P8_L2.5-W1.0-P0.50-BL]  (value not drawn)
D3  RClamp0524PATCT  [SLP2510P8_L2.5-W1.0-P0.50-BL]  (value not drawn)
D4  DSK24  [SOD-123FL_L2.7-W1.8-LS3.8-RD]  (value not drawn)
D5  DSK24  [SOD-123FL_L2.7-W1.8-LS3.8-RD]  (value not drawn)
J1  HR911105A_C12074  [RJ45-TH_HR911105A]  (value not drawn)
R14  100Ω  [R0402]
R15  27kΩ  [R0402]
R16  510Ω  [R0402]
R17  100Ω  [R0402]
R18  100kΩ  [R0402]
R19  10kΩ  [R0402]
R20  100Ω  [R0402]
R21  10kΩ  [R0402]
R22  6.04kΩ  [R0402]
R23  22Ω  [R0402]
R24  22Ω  [R0402]
R25  22Ω  [R0402]
R26  22Ω  [R0402]
R27  22Ω  [R0402]
R28  22Ω  [R0402]
R29  22Ω  [R0402]
R30  22Ω  [R0402]
R31  150kΩ  [R0402]
R32  0Ω  [R0402]
R33  5.1kΩ  [R0402]
R34  22Ω  [R0402]
R35  22Ω  [R0402]
R36  75Ω  [R0402]
R37  5.1kΩ  [R0402]
U3  ESD5451N  [DFN1006-2L-BI]  (value not drawn)
U4  ESD5451N  [DFN1006-2L-BI]  (value not drawn)
U5  ESD5451N  [DFN1006-2L-BI]  (value not drawn)
USB2  USB-303WSD-BRY  [USB-A-TH_XUNPU_USB-303WSD-BRY]  (value not drawn)
USB3  TYPE-C 16PIN 2MD(073)  [USB-C-SMD_TYPE-C-6PIN-2MD-073]
X1  24MHz  [CRYSTAL-SMD_4P-L3.2-W2.5-BL]  (value not drawn)

### Blocks framed on the sheet
SoC_Connector: *1 C34-C41 R22-R32 X1
HDMI: CN1 D2-D5 R14-R21
Ethernet: C32 C33 J1
USB-HOST: R33 R37 USB2 USB3
HPJ: AUDIO1 C42-C44 R34-R36 U3-U5

### Ports
D0_N (bidir, see OVERVIEW[2C], SoC_PWR[7C]), D0_P (bidir, see OVERVIEW[2C], SoC_PWR[7C]), RESET (bidir, see OVERVIEW[2C], SoC_PWR[7D]), VCC_5V (bidir, see OVERVIEW[2C], SoC_PWR[7D]), VDD_1V8 (bidir, see OVERVIEW[2C], SoC_DDR[2D], SoC_PWR[7D]), VDD_3V3 (bidir, see OVERVIEW[2C], SoC_PWR[7D], SoC_SDIO[5D], WiFi_TF_EMMC[5D])

### Nets
GND: AUDIO1.1 AUDIO1.8 C32.1 C33.1 C36.2 C37.1 C38.1 C39.1 C40.1 C41.1 C42.2 CN1.2(TMDS_DATA2_SHIELD) CN1.5(TMDS_DATA1_SHIELD) CN1.8(TMDS_DATA0_SHIELD) CN1.11(TMDS_CLOCK_SHIELD) CN1.20(SHIELD) CN1.21(SHIELD) CN1.22(SHIELD) CN1.23(SHIELD) D2.3(GND) D2.8(GND) D3.3(GND) D3.8(GND) J1.8(CHS_GND) R18.2 R22.2 R32.1 R33.2 R35.1 R36.1 R37.2 U3.1 U4.1 U5.1 USB2.4(GND1) USB2.7(GND_DRAIN1) USB2.13(GND2) USB2.16(GND_DRAIN2) USB2.19(Shield) USB2.20(Shield) USB2.21(Shield) USB2.22(Shield) USB3.1(GND) USB3.12(GND) USB3.13(SHELL) USB3.14(SHELL) X1.2(GND) X1.4(GND)
HDMI_5V: CN1.18(+5V) D4.1(C) R19.1 R21.1
VCC_5V: D4.2(A) USB2.1(VBUS1) USB2.10(VBUS2) USB3.2(VBUS) USB3.11(VBUS) ; port VCC_5V
VDD_1V8: *1.D11(VCC_DCXO) *1.D12(VCC_PLL) *1.F18(VCC_HDMI) *1.H17(AVCC) *1.H20(VCC_TV) C39.2 ; port VDD_1V8
VDD_3V3: *1.E18(VCC_EPHY) *1.M18(VCC_USB) D5.2(A) ; port VDD_3V3
D0_N: R24.2 ; port D0_N
D0_P: R23.2 ; port D0_P
D1_N: R26.2 USB2.2(D1-)
D1_P: R25.2 USB2.3(D1+)
D2_N: R28.2 USB2.11(D2-)
D2_P: R27.2 USB2.12(D2+)
D3_N: R30.2 USB3.5(DN2) USB3.7(DN1)
D3_P: R29.2 USB3.6(DP1) USB3.8(DP2)
EPHY_RX_N: *1.B21(EPHY_RXN) J1.6(RD-)
EPHY_RX_P: *1.B20(EPHY_RXP) J1.3(RD+)
EPHY_TX_N: *1.A20(EPHY_TXN) J1.2(TD-)
EPHY_TX_P: *1.A19(EPHY_TXP) J1.1(TD+)
FEL: *1.B17(FEL)
HCEC: *1.G17(HCEC) R14.1
HDCEC: CN1.13(CEC) R14.2 R15.2
HDHPD: CN1.19(HOT_PLUG_DET) R16.2
HDMI0_N: *1.E20(HTX0N) CN1.9(TMDS_DATA0-) D3.2(IN2) D3.9(NC)
HDMI0_P: *1.E19(HTX0P) CN1.7(TMDS_DATA0+) D3.1(IN1) D3.10(NC)
HDMI1_N: *1.D21(HTX1N) CN1.6(TMDS_DATA1-) D2.5(IN4) D2.6(NC)
HDMI1_P: *1.D20(HTX1P) CN1.4(TMDS_DATA1+) D2.4(IN3) D2.7(NC)
HDMI2_N: *1.C20(HTX2N) CN1.3(TMDS_DATA2-) D2.2(IN2) D2.9(NC)
HDMI2_P: *1.C19(HTX2P) CN1.1(TMDS_DATA2+) D2.1(IN1) D2.10(NC)
HDMIC_N: *1.F21(HTXCN) CN1.12(TMDS_CLOCK-) D3.5(IN4) D3.6(NC)
HDMIC_P: *1.F20(HTXCP) CN1.10(TMDS_CLOCK+) D3.4(IN3) D3.7(NC)
HDSCL: CN1.15(SCL) R17.2 R19.2
HDSDA: CN1.16(SDA) R20.2 R21.2
HHPD: *1.G18(HHPD) R16.1 R18.1
HSCL: *1.F19(HSCL) R17.1
HSDA: *1.G21(HSDA) R20.1
HXIN: *1.B11(DXIN) C36.1 X1.3(OSC2)
HXOUT: *1.C12(DXOUT) C41.2 X1.1(OSC1)
LL: *1.G19(LINEOUTL) C43.1 R34.2
LR: *1.G20(LINEOUTR) C44.1 R35.2
RESET: *1.A16(RESET) ; port RESET
TV_OUT: *1.J21(TV_OUT) AUDIO1.4 AUDIO1.7 R36.2 U5.2
Net*1_B19: *1.B19(EPHY_RTX) R22.1
Net*1_C17: *1.C17(AC_VRA1) C38.2
Net*1_D13: *1.D13(DXLDO_OUT) C40.2
Net*1_D18: *1.D18(AC_AVCC) C37.2
Net*1_H18: *1.H18(AGND) C34.1 C35.1 R31.1 R32.2
Net*1_J17: *1.J17(VRA2) C35.2
Net*1_J18: *1.J18(VRA1) C34.2
Net*1_J19: *1.J19(USB0_DM) R23.1
Net*1_J20: *1.J20(USB0_DP) R24.1
Net*1_K18: *1.K18(REXT) R31.2
Net*1_K19: *1.K19(USB2_DM) R27.1
Net*1_K20: *1.K20(USB2_DP) R28.1
Net*1_L19: *1.L19(USB3_DM) R29.1
Net*1_L20: *1.L20(USB3_DP) R30.1
Net*1_M19: *1.M19(USB1_DM) R25.1
Net*1_M20: *1.M20(USB1_DP) R26.1
NetAUDIO1_2: AUDIO1.2 AUDIO1.5 C43.2 U3.2
NetAUDIO1_3: AUDIO1.3 AUDIO1.6 C44.2 U4.2
NetC32_2: C32.2 J1.5
NetC33_2: C33.2 J1.4
NetC42_1: C42.1 R34.1
NetD5_1: D5.1(C) R15.1
NetR33_1: R33.1 USB3.4(CC1)
NetR37_1: R37.1 USB3.10(CC2)

Not connected (* = marked no-connect by the designer): *1 C11(REFCLK_OUT)* C16(JTAG_SEL)* D14(PLLTEST)* L18(LRADC)*; CN1 14(UTILITY)* 17(DDC/CEC_GND)*; J1 7(NC)* 9 10 11 12 SH1 SH2; USB2 5(StdA_SSRX1-)* 6(StdA_SSRX1+)* 8(StdA_SSTX1-)* 9(StdA_SSTX1+)* 14(StdA_SSRX2-)* 15(StdA_SSRX2+)* 17(StdA_SSTX2-)* 18(StdA_SSTX2+)*; USB3 3(SBU2)* 9(SBU1)*

### Notes on the sheet
- (in symbol HR911105A_C12074) J8; 1CT:1CT; J7; J6 RX-; J5; J4; J3 RX+; J2 TX-; J1 TX+; 1000pF; 4X75 ohms; 2KV; Green LED; Yellow LED

### Library data of the parts
*1 = H616-BGA-190823: Allwinner H616; Symbol: H616-BGA-190823
AUDIO1 = PJ-3930-8A: 3.5mm耳机座; Symbol: PJ-3930-8A
C32 C33 C39 C42 = 100nF: as C9 on sheet SoC_PWR
C34 C35 = 470nF: 25V 470nF X5R ±10% 0402 Ceramic Capacitors ROHS
C36 C41 = 22pF: 50V 22pF C0G ±5% 0402 Ceramic Capacitors ROHS
C37 = 2.2uF: 50V 2.2uF NP0 0402 Ceramic Capacitors ROHS
C38 = 1uF: as C8 on sheet SoC_PWR
C40 = 220nF: 16V 220nF X7R ±10% 0402 Ceramic Capacitors ROHS
C43 C44 = 4.7uF: as C3 on sheet SoC_PWR
CN1 = KH-HDMI-19P-Cu: HDMI-A SMD USB, DVI, HDMI Connector Assemblies ROHS; Manufacturer: kinghelm(金航标); Add into BOM: yes; Gender: Mother; Symbol: KH-HDMI-19P-CU; Device: KH-HDMI-19P-Cu; LCSC Part Name: KH-HDMI-19P-Cu; Supplier Part: C709361; Manufacturer Part: KH-HDMI-19P-Cu; Supplier Footprint: SMD; JLCPCB Part Class: Extended Part; Datasheet: https://atta.szlcsc.com/upload/public/pdf/source/20211208/D47DE7411E98B8CA58BDDFA754B04DEC.pdf; Supplier: LCSC; Convert to PCB: yes; Connector Type: HDMI-A; Number of Pins: 19P; Mounting Style: Horizontal attachment; Current Rating (Max): -; Rated Voltage (Max): -; Operating Temperature Range: -
D2 D3 = RClamp0524PATCT: ESD 5V截止 峰值浪涌电流：5A@8/20us; Symbol: RClamp0524PATCT
D4 D5 = DSK24: as D1 on sheet SoC_PWR; LCSC Part Name: 耐压/V 5V-440V 峰值脉冲功率 400W; Supplier Part: C83329; Supplier Footprint: DO-214AC(SMA); JLCPCB Part Class: Extended Part; Datasheet: https://item.szlcsc.com/datasheet/SMAJ5.0A/84493.html; Supplier: LCSC; Convert to PCB: yes; Operating Temperature: -65℃~+150℃
J1 = HR911105A_C12074: Ethernet 弯插 带LED; Symbol: HR911105A_C12074
R14 R17 R20 = 100Ω: as R1 on sheet SoC_DDR
R15 = 27kΩ: 小尺寸、重量轻。降低组装成本,与贴片机匹配。适用于波峰焊和回流焊
R16 = 510Ω: 510Ω 62.5mW 50V ±100ppm/℃ Thick Film Resistor ±1% 0402 Chip Resistor - Surface Mount ROHS
R18 = 100kΩ: 100kΩ 62.5mW 50V ±100ppm/℃ Thick Film Resistor ±1% 0402 Chip Resistor - Surface Mount ROHS
R19 R21 = 10kΩ: as R9 on sheet SoC_PWR
R22 = 6.04kΩ: 6.04kΩ 62.5mW 50V ±100ppm/℃ Thick Film Resistor ±1% 0402 Chip Resistor - Surface Mount ROHS
R23-R30 R34 R35 = 22Ω: 小尺寸、重量轻。降低组装成本,与贴片机匹配。适用于波峰焊和回流焊
R31 = 150kΩ: 62.5mW 150kΩ 50V ±100ppm/℃ Thick Film Resistor ±1% 0402 Chip Resistor - Surface Mount ROHS
R32 = 0Ω: 0Ω 62.5mW 50V Thick Film Resistor ±1% 0402 Chip Resistor - Surface Mount ROHS
R33 R37 = 5.1kΩ: as R7 on sheet SoC_PWR
R36 = 75Ω: 小尺寸、重量轻。降低组装成本,与贴片机匹配。适用于波峰焊和回流焊
U3-U5 = ESD5451N_C5261080: 9A 9.8V 8V Bidirectional 5V DFN1006-2L TVS Diodes ROHS; Manufacturer: HXY MOSFET(华轩阳电子); Add into BOM: yes; Reverse Leakage Current (Ir): 500nA; Number of Channels: 1.0; level of protection: IEC 61000-4-2; Junction Capacitance: 15pF; Symbol: ESD5451N_C5261080; Device: ESD5451N_C5261080; LCSC Part Name: 5V 15pF 双向; Supplier Part: C5261080; Manufacturer Part: ESD5451N; Supplier Footprint: DFN1006-2L; JLCPCB Part Class: Extended Part; Datasheet: https://item.szlcsc.com/datasheet/ESD5451N/5983779.html; Supplier: LCSC; Convert to PCB: yes; Polarity: Bidirectional; Reverse Stand-Off Voltage (Vrwm): 5V; Clamping Voltage: 9.8V; Peak Pulse Current (Ipp): 9A; Voltage - Breakdown: 8V; Type: ESD
USB2 = USB-303WSD-BRY: USB 3.0 2 9Px2 -30℃~+85℃ Type-A Through Hole,Right Angle USB, DVI, HDMI Connector Assemblies ROHS; Manufacturer: XUNPU(讯普); Add into BOM: yes; Protocol Standard: USB 3.0; Gender: Female; Number of Ports: 2; Current Rating-Power: 1.8A; Voltage Rating: 30V; Detection color: Blue; Symbol: USB-303WSD-BRY; Device: USB-303WSD-BRY; Supplier Part: C2895028; Manufacturer Part: USB-303WSD-BRY; Supplier Footprint: 插件; JLCPCB Part Class: Extended Part; Datasheet: https://item.szlcsc.com/datasheet/USB-303WSD-BRY/3132965.html; Supplier: LCSC; Convert to PCB: yes; Connector Type: Type-A; Mounting Type: Right Angle; Number of Contacts: 9Px2; Length: -; Operating Temperature: -30℃~+85℃; LCSC Part Name: Type-A 母 弯插
USB3 = TYPE-C 16PIN 2MD(073): 16pin type-c
X1 = X322524MOB4SI: Crystal Oscillator 12pF SMD3225-4P Crystals ROHS; Manufacturer: YXC(扬兴晶振); Add into BOM: yes; Normal temperature Frequency Tolerance: ±10ppm; Frequency Stability: ±20ppm; Symbol: X322524MOB4SI; Device: X322524MOB4SI; LCSC Part Name: YSX321SL 24MHZ 4P 3225 12PF ±10PPM -40~85℃ (±20PPM); Supplier Part: C70590; Manufacturer Part: X322524MOB4SI; Supplier Footprint: SMD3225-4P; JLCPCB Part Class: Extended Part; Datasheet: https://item.szlcsc.com/datasheet/X322524MOB4SI/71688.html; Supplier: LCSC; Convert to PCB: yes; Type: Surface Mount Crystal; Value: 24MHz; Load Capacitance: 12pF; Operating Temperature: -40℃~+85℃

## Sheet SoC_SDIO.SchDoc
size A3; SheetNumber: 5; SheetTotal: 6
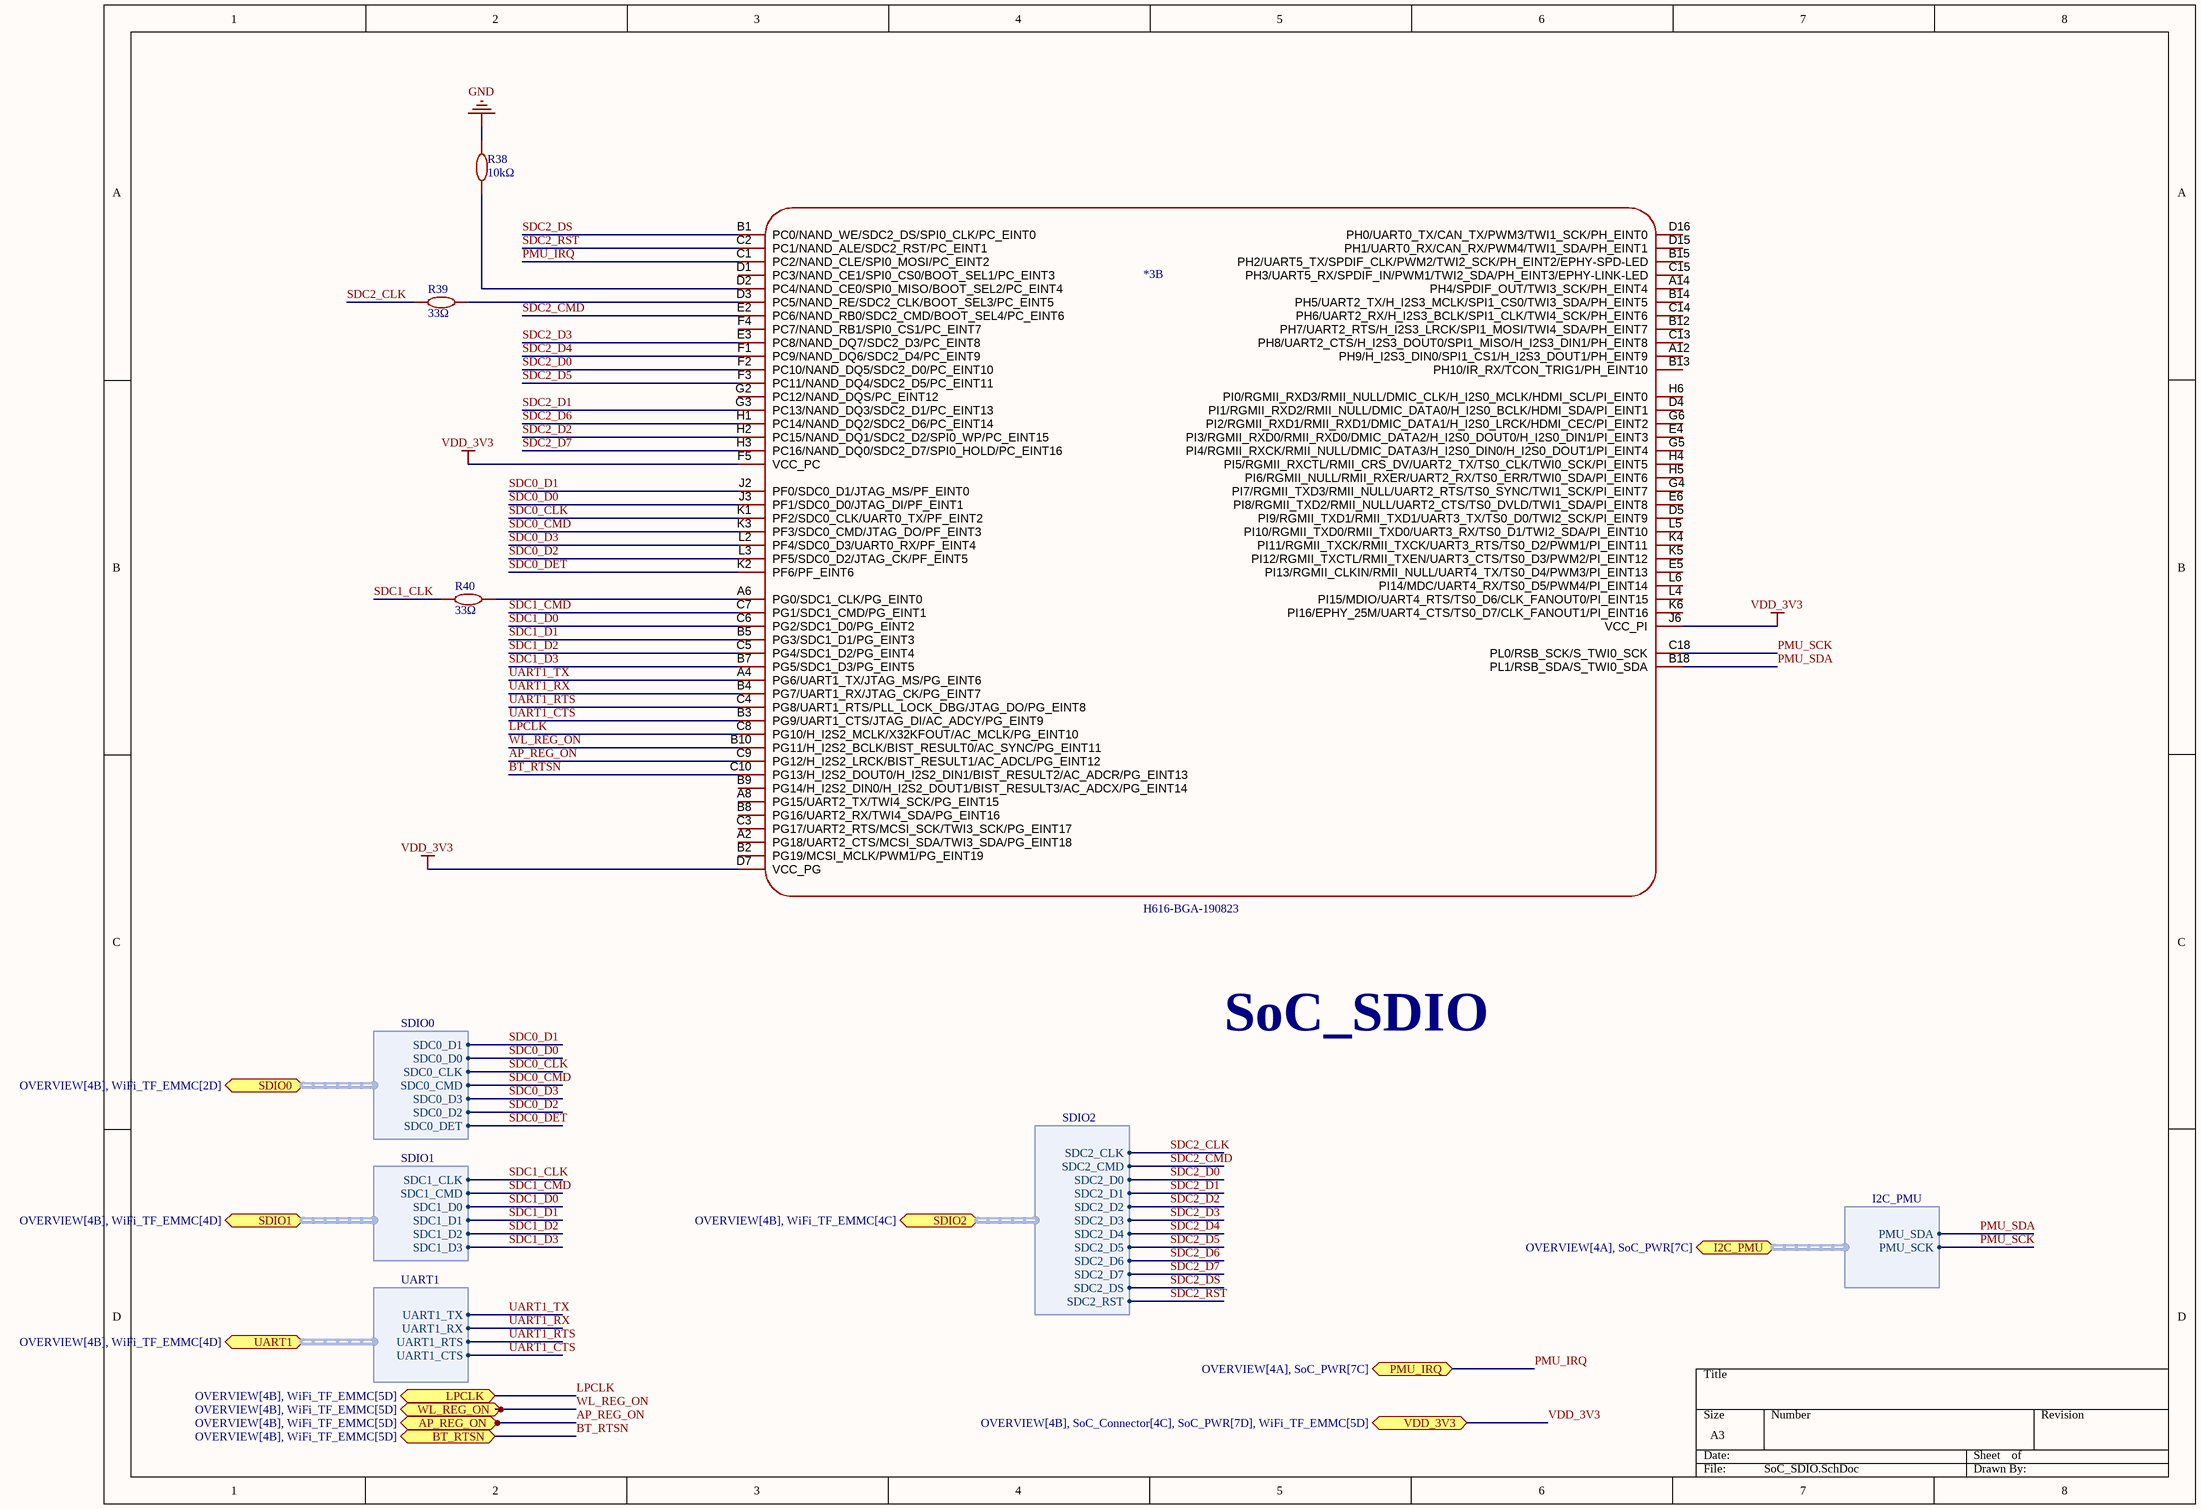
[diagram p4: SoC_SDIO.SchDoc]

### Parts
*3  H616-BGA-190823  [BGA-284_L14.0-W12.0-P0.65-TL]  (part B of 4)
R38  10kΩ  [R0402]
R39  33Ω  [R0402]
R40  33Ω  [R0402]

### Ports
AP_REG_ON (bidir, see OVERVIEW[4B], WiFi_TF_EMMC[5D]), BT_RTSN (bidir, see OVERVIEW[4B], WiFi_TF_EMMC[5D]), I2C_PMU (bidir, harness I2C_PMU, see OVERVIEW[4A], SoC_PWR[7C]), LPCLK (bidir, see OVERVIEW[4B], WiFi_TF_EMMC[5D]), PMU_IRQ (bidir, see OVERVIEW[4A], SoC_PWR[7C]), SDIO0 (bidir, harness SDIO0, see OVERVIEW[4B], WiFi_TF_EMMC[2D]), SDIO1 (bidir, harness SDIO1, see OVERVIEW[4B], WiFi_TF_EMMC[4D]), SDIO2 (bidir, harness SDIO2, see OVERVIEW[4B], WiFi_TF_EMMC[4C]), UART1 (bidir, harness UART1, see OVERVIEW[4B], WiFi_TF_EMMC[4D]), VDD_3V3 (bidir, see OVERVIEW[4B], SoC_Connector[4C], SoC_PWR[7D], WiFi_TF_EMMC[5D]), WL_REG_ON (bidir, see OVERVIEW[4B], WiFi_TF_EMMC[5D])

### Harnesses
SDIO1: SDC1_D0, SDC1_D1, SDC1_CMD, SDC1_D2, SDC1_D3, SDC1_CLK
UART1: UART1_RX, UART1_RTS, UART1_TX, UART1_CTS
SDIO0: SDC0_CLK, SDC0_CMD, SDC0_D0, SDC0_D3, SDC0_D2, SDC0_D1, SDC0_DET
I2C_PMU: PMU_SDA, PMU_SCK
SDIO2: SDC2_D2, SDC2_D3, SDC2_D1, SDC2_D4, SDC2_D5, SDC2_D0, SDC2_CMD, SDC2_CLK, SDC2_D6, SDC2_D7, SDC2_DS, SDC2_RST

### Nets
GND: R38.2
VDD_3V3: *3.D7(VCC_PG) *3.F5(VCC_PC) *3.J6(VCC_PI) ; port VDD_3V3
AP_REG_ON: *3.C9(PG12/H_I2S2_LRCK/BIST_RESULT1/AC_ADCL/PG_EINT12) ; port AP_REG_ON
BT_RTSN: *3.C10(PG13/H_I2S2_DOUT0/H_I2S2_DIN1/BIST_RESULT2/AC_ADCR/PG_EINT13) ; port BT_RTSN
LPCLK: *3.C8(PG10/H_I2S2_MCLK/X32KFOUT/AC_MCLK/PG_EINT10) ; port LPCLK
PMU_IRQ: *3.C1(PC2/NAND_CLE/SPI0_MOSI/PC_EINT2) ; port PMU_IRQ
PMU_SCK: *3.C18(PL0/RSB_SCK/S_TWI0_SCK) ; port I2C_PMU.PMU_SCK
PMU_SDA: *3.B18(PL1/RSB_SDA/S_TWI0_SDA) ; port I2C_PMU.PMU_SDA
SDC0_CLK: *3.K1(PF2/SDC0_CLK/UART0_TX/PF_EINT2) ; port SDIO0.SDC0_CLK
SDC0_CMD: *3.K3(PF3/SDC0_CMD/JTAG_DO/PF_EINT3) ; port SDIO0.SDC0_CMD
SDC0_D0: *3.J3(PF1/SDC0_D0/JTAG_DI/PF_EINT1) ; port SDIO0.SDC0_D0
SDC0_D1: *3.J2(PF0/SDC0_D1/JTAG_MS/PF_EINT0) ; port SDIO0.SDC0_D1
SDC0_D2: *3.L3(PF5/SDC0_D2/JTAG_CK/PF_EINT5) ; port SDIO0.SDC0_D2
SDC0_D3: *3.L2(PF4/SDC0_D3/UART0_RX/PF_EINT4) ; port SDIO0.SDC0_D3
SDC0_DET: *3.K2(PF6/PF_EINT6) ; port SDIO0.SDC0_DET
SDC1_CLK: R40.1 ; port SDIO1.SDC1_CLK
SDC1_CMD: *3.C7(PG1/SDC1_CMD/PG_EINT1) ; port SDIO1.SDC1_CMD
SDC1_D0: *3.C6(PG2/SDC1_D0/PG_EINT2) ; port SDIO1.SDC1_D0
SDC1_D1: *3.B5(PG3/SDC1_D1/PG_EINT3) ; port SDIO1.SDC1_D1
SDC1_D2: *3.C5(PG4/SDC1_D2/PG_EINT4) ; port SDIO1.SDC1_D2
SDC1_D3: *3.B7(PG5/SDC1_D3/PG_EINT5) ; port SDIO1.SDC1_D3
SDC2_CLK: R39.1 ; port SDIO2.SDC2_CLK
SDC2_CMD: *3.E2(PC6/NAND_RB0/SDC2_CMD/BOOT_SEL4/PC_EINT6) ; port SDIO2.SDC2_CMD
SDC2_D0: *3.F2(PC10/NAND_DQ5/SDC2_D0/PC_EINT10) ; port SDIO2.SDC2_D0
SDC2_D1: *3.G3(PC13/NAND_DQ3/SDC2_D1/PC_EINT13) ; port SDIO2.SDC2_D1
SDC2_D2: *3.H2(PC15/NAND_DQ1/SDC2_D2/SPI0_WP/PC_EINT15) ; port SDIO2.SDC2_D2
SDC2_D3: *3.E3(PC8/NAND_DQ7/SDC2_D3/PC_EINT8) ; port SDIO2.SDC2_D3
SDC2_D4: *3.F1(PC9/NAND_DQ6/SDC2_D4/PC_EINT9) ; port SDIO2.SDC2_D4
SDC2_D5: *3.F3(PC11/NAND_DQ4/SDC2_D5/PC_EINT11) ; port SDIO2.SDC2_D5
SDC2_D6: *3.H1(PC14/NAND_DQ2/SDC2_D6/PC_EINT14) ; port SDIO2.SDC2_D6
SDC2_D7: *3.H3(PC16/NAND_DQ0/SDC2_D7/SPI0_HOLD/PC_EINT16) ; port SDIO2.SDC2_D7
SDC2_DS: *3.B1(PC0/NAND_WE/SDC2_DS/SPI0_CLK/PC_EINT0) ; port SDIO2.SDC2_DS
SDC2_RST: *3.C2(PC1/NAND_ALE/SDC2_RST/PC_EINT1) ; port SDIO2.SDC2_RST
UART1_CTS: *3.B3(PG9/UART1_CTS/JTAG_DI/AC_ADCY/PG_EINT9) ; port UART1.UART1_CTS
UART1_RTS: *3.C4(PG8/UART1_RTS/PLL_LOCK_DBG/JTAG_DO/PG_EINT8) ; port UART1.UART1_RTS
UART1_RX: *3.B4(PG7/UART1_RX/JTAG_CK/PG_EINT7) ; port UART1.UART1_RX
UART1_TX: *3.A4(PG6/UART1_TX/JTAG_MS/PG_EINT6) ; port UART1.UART1_TX
WL_REG_ON: *3.B10(PG11/H_I2S2_BCLK/BIST_RESULT0/AC_SYNC/PG_EINT11) ; port WL_REG_ON
Net*3_A6: *3.A6(PG0/SDC1_CLK/PG_EINT0) R40.2
Net*3_D2: *3.D2(PC4/NAND_CE0/SPI0_MISO/BOOT_SEL2/PC_EINT4) R38.1
Net*3_D3: *3.D3(PC5/NAND_RE/SDC2_CLK/BOOT_SEL3/PC_EINT5) R39.2

Not connected (* = marked no-connect by the designer): *3 A2(PG18/UART2_CTS/MCSI_SDA/TWI3_SDA/PG_EINT18) A8(PG15/UART2_TX/TWI4_SCK/PG_EINT15) A12(PH9/H_I2S3_DIN0/SPI1_CS1/H_I2S3_DOUT1/PH_EINT9) A14(PH4/SPDIF_OUT/TWI3_SCK/PH_EINT4) B2(PG19/MCSI_MCLK/PWM1/PG_EINT19) B8(PG16/UART2_RX/TWI4_SDA/PG_EINT16) B9(PG14/H_I2S2_DIN0/H_I2S2_DOUT1/BIST_RESULT3/AC_ADCX/PG_EINT14) B12(PH7/UART2_RTS/H_I2S3_LRCK/SPI1_MOSI/TWI4_SDA/PH_EINT7) B13(PH10/IR_RX/TCON_TRIG1/PH_EINT10) B14(PH5/UART2_TX/H_I2S3_MCLK/SPI1_CS0/TWI3_SDA/PH_EINT5) B15(PH2/UART5_TX/SPDIF_CLK/PWM2/TWI2_SCK/PH_EINT2/EPHY-SPD-LED) C3(PG17/UART2_RTS/MCSI_SCK/TWI3_SCK/PG_EINT17) C13(PH8/UART2_CTS/H_I2S3_DOUT0/SPI1_MISO/H_I2S3_DIN1/PH_EINT8) C14(PH6/UART2_RX/H_I2S3_BCLK/SPI1_CLK/TWI4_SCK/PH_EINT6) C15(PH3/UART5_RX/SPDIF_IN/PWM1/TWI2_SDA/PH_EINT3/EPHY-LINK-LED) D1(PC3/NAND_CE1/SPI0_CS0/BOOT_SEL1/PC_EINT3) D4(PI1/RGMII_RXD2/RMII_NULL/DMIC_DATA0/H_I2S0_BCLK/HDMI_SDA/PI_EINT1) D5(PI9/RGMII_TXD1/RMII_TXD1/UART3_TX/TS0_D0/TWI2_SCK/PI_EINT9) D15(PH1/UART0_RX/CAN_RX/PWM4/TWI1_SDA/PH_EINT1) D16(PH0/UART0_TX/CAN_TX/PWM3/TWI1_SCK/PH_EINT0) E4(PI3/RGMII_RXD0/RMII_RXD0/DMIC_DATA2/H_I2S0_DOUT0/H_I2S0_DIN1/PI_EINT3) E5(PI13/RGMII_CLKIN/RMII_NULL/UART4_TX/TS0_D4/PWM3/PI_EINT13) E6(PI8/RGMII_TXD2/RMII_NULL/UART2_CTS/TS0_DVLD/TWI1_SDA/PI_EINT8) F4(PC7/NAND_RB1/SPI0_CS1/PC_EINT7) G2(PC12/NAND_DQS/PC_EINT12) G4(PI7/RGMII_TXD3/RMII_NULL/UART2_RTS/TS0_SYNC/TWI1_SCK/PI_EINT7) G5(PI4/RGMII_RXCK/RMII_NULL/DMIC_DATA3/H_I2S0_DIN0/H_I2S0_DOUT1/PI_EINT4) G6(PI2/RGMII_RXD1/RMII_RXD1/DMIC_DATA1/H_I2S0_LRCK/HDMI_CEC/PI_EINT2) H4(PI5/RGMII_RXCTL/RMII_CRS_DV/UART2_TX/TS0_CLK/TWI0_SCK/PI_EINT5) H5(PI6/RGMII_NULL/RMII_RXER/UART2_RX/TS0_ERR/TWI0_SDA/PI_EINT6) H6(PI0/RGMII_RXD3/RMII_NULL/DMIC_CLK/H_I2S0_MCLK/HDMI_SCL/PI_EINT0) K4(PI11/RGMII_TXCK/RMII_TXCK/UART3_RTS/TS0_D2/PWM1/PI_EINT11) K5(PI12/RGMII_TXCTL/RMII_TXEN/UART3_CTS/TS0_D3/PWM2/PI_EINT12) K6(PI16/EPHY_25M/UART4_CTS/TS0_D7/CLK_FANOUT1/PI_EINT16) L4(PI15/MDIO/UART4_RTS/TS0_D6/CLK_FANOUT0/PI_EINT15) L5(PI10/RGMII_TXD0/RMII_TXD0/UART3_RX/TS0_D1/TWI2_SDA/PI_EINT10) L6(PI14/MDC/UART4_RX/TS0_D5/PWM4/PI_EINT14)

### Notes on the sheet
- SoC_SDIO

### Library data of the parts
*3 = H616-BGA-190823: Allwinner H616; Symbol: H616-BGA-190823
R38 = 10kΩ: as R9 on sheet SoC_PWR
R39 R40 = 33Ω: 62.5mW 33Ω 50V ±100ppm/℃ Thick Film Resistor ±1% 0402 Chip Resistor - Surface Mount ROHS

## Sheet WiFi_TF_EMMC.SchDoc
size A3; SheetNumber: 6; SheetTotal: 6
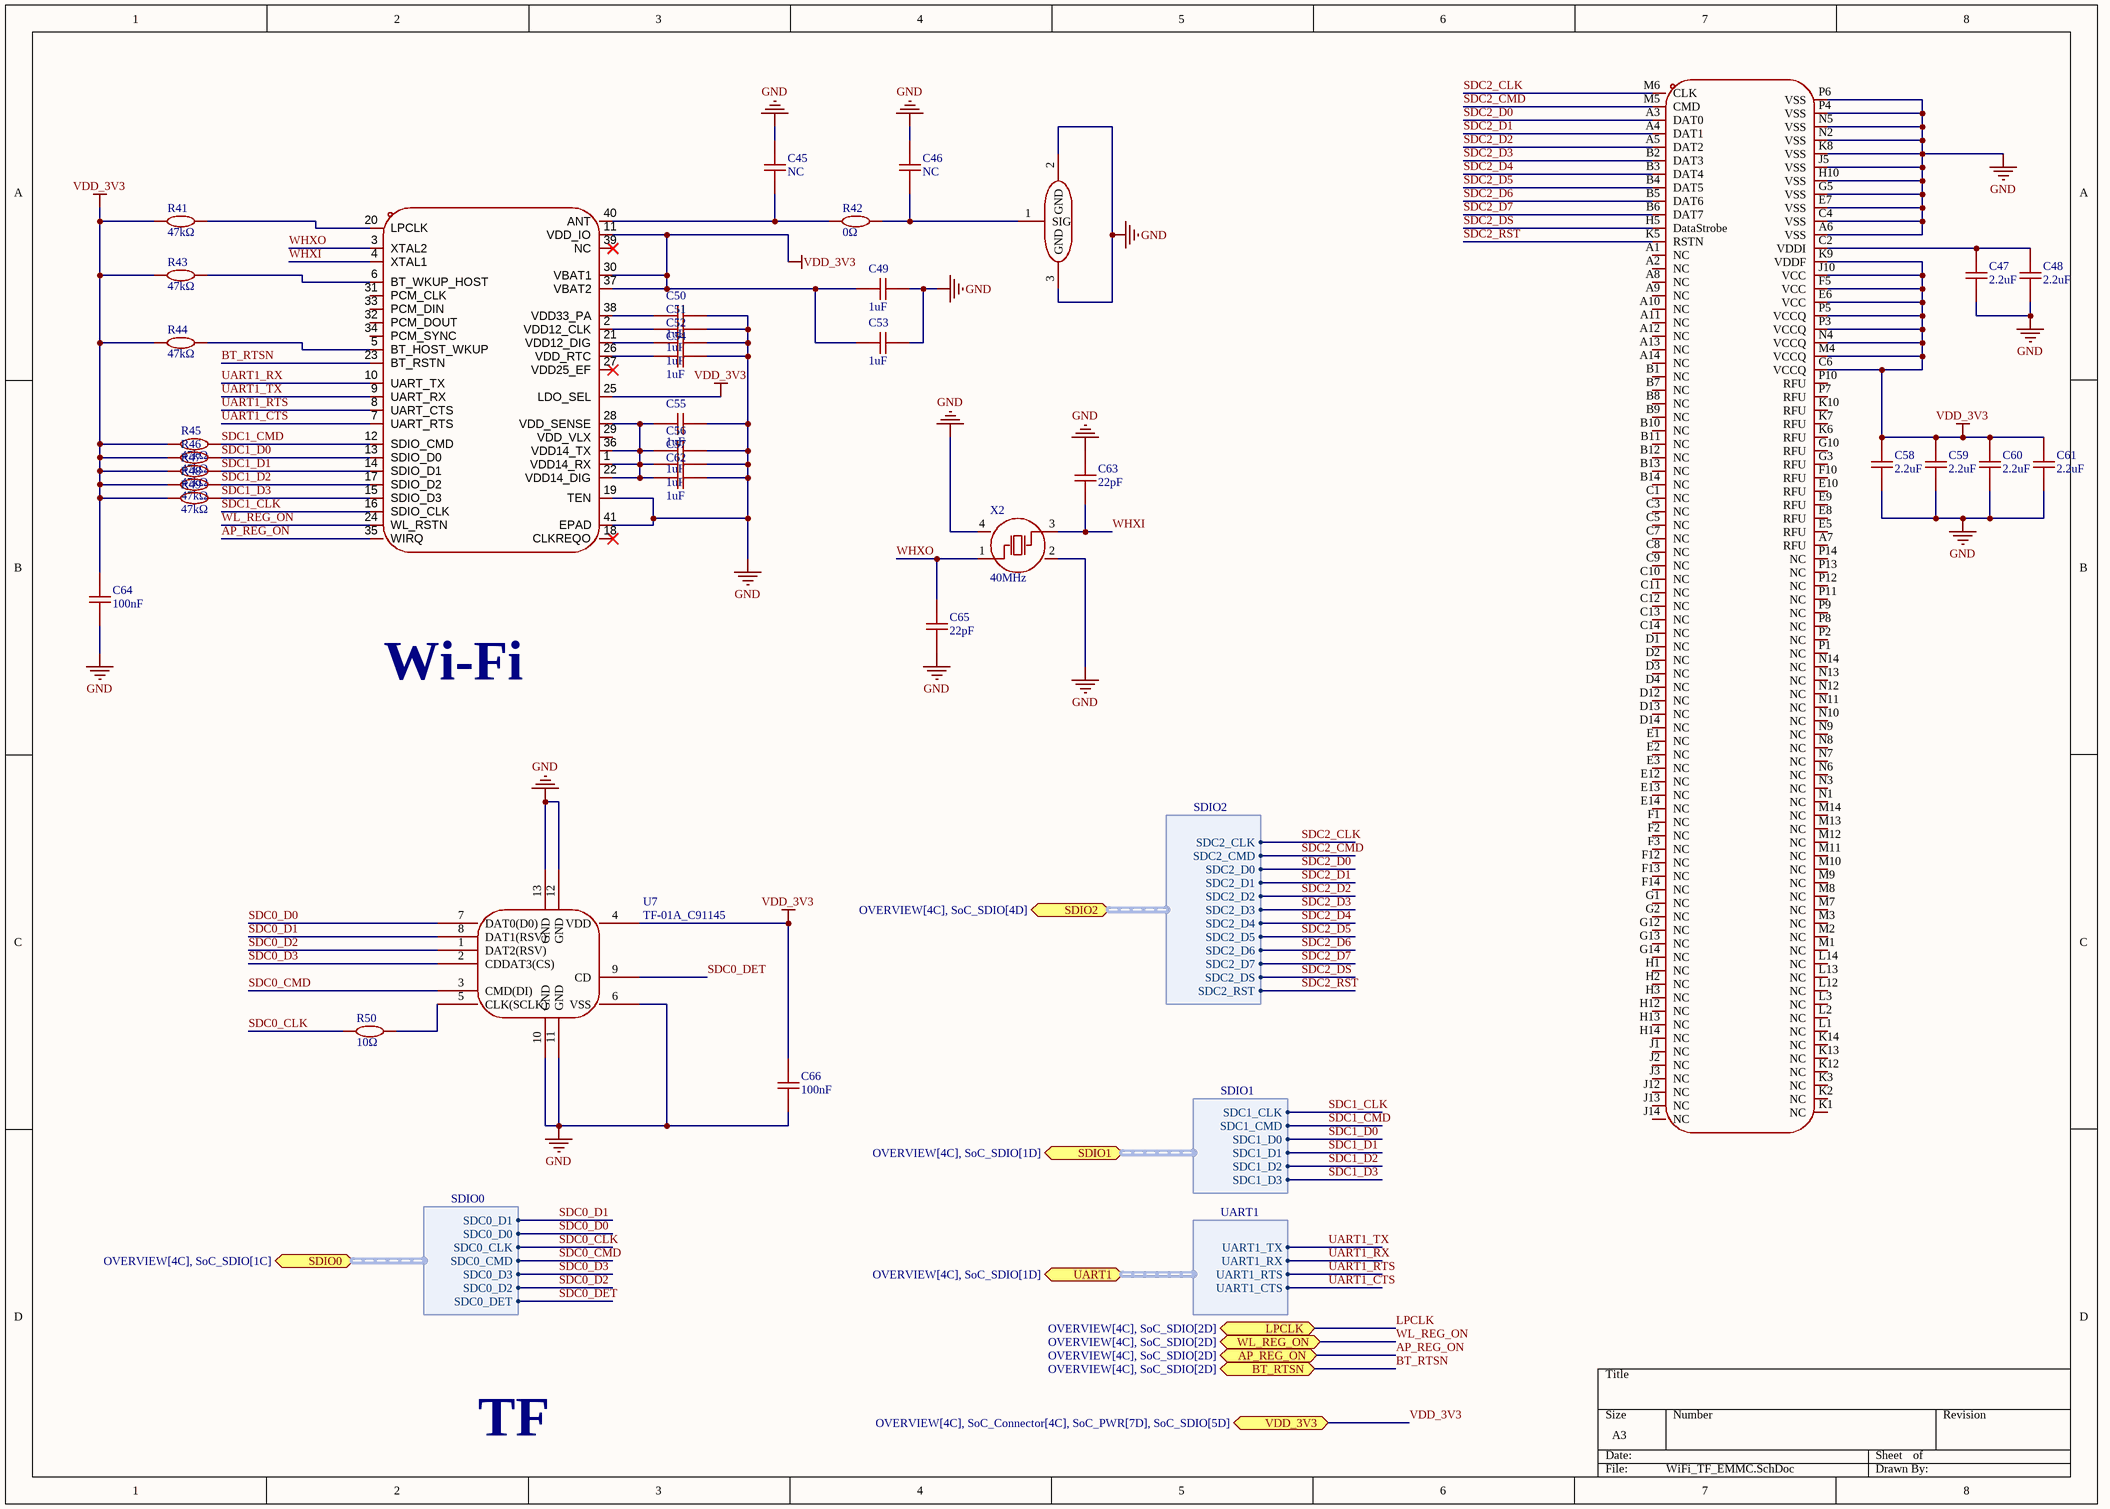
[diagram p5: WiFi_TF_EMMC.SchDoc]

### Parts
C45  NC  [C0402]
C46  NC  [C0402]
C47  2.2uF  [C0402]
C48  2.2uF  [C0402]
C49  1uF  [C0402]
C50  1uF  [C0402]
C51  1uF  [C0402]
C52  1uF  [C0402]
C53  1uF  [C0402]
C54  1uF  [C0402]
C55  1uF  [C0402]
C56  1uF  [C0402]
C57  1uF  [C0402]
C58  2.2uF  [C0402]
C59  2.2uF  [C0402]
C60  2.2uF  [C0402]
C61  2.2uF  [C0402]
C62  1uF  [C0402]
C63  22pF  [C0402]
C64  100nF  [C0402]
C65  22pF  [C0402]
C66  100nF  [C0402]
JP1  6GHz  [RF-SMD_FRF05002-JSS103M]  (value not drawn)
R41  47kΩ  [R0402]
R42  0Ω  [R0402]
R43  47kΩ  [R0402]
R44  47kΩ  [R0402]
R45  47kΩ  [R0402]
R46  47kΩ  [R0402]
R47  47kΩ  [R0402]
R48  47kΩ  [R0402]
R49  47kΩ  [R0402]
R50  10Ω  [R0402]
U6  XR829  [QFN-40_L5.0-W5.0-P0.40-BL-EP3.4]  (value not drawn)
U7  TF-01A_C91145  [TF-SMD_TF-01A]
U8  KLM8G1GETF-B041  [FBGA-153_L13.0-W11.5-P0.50_KLMAG1JETD-B041]  (value not drawn)
X2  40MHz  [OSC-SMD_4P-L3.2-W2.5-BL_SIT8008BI]

### Ports
AP_REG_ON (bidir, see OVERVIEW[4C], SoC_SDIO[2D]), BT_RTSN (bidir, see OVERVIEW[4C], SoC_SDIO[2D]), LPCLK (bidir, see OVERVIEW[4C], SoC_SDIO[2D]), SDIO0 (bidir, harness SDIO0, see OVERVIEW[4C], SoC_SDIO[1C]), SDIO1 (bidir, harness SDIO1, see OVERVIEW[4C], SoC_SDIO[1D]), SDIO2 (bidir, harness SDIO2, see OVERVIEW[4C], SoC_SDIO[4D]), UART1 (bidir, harness UART1, see OVERVIEW[4C], SoC_SDIO[1D]), VDD_3V3 (bidir, see OVERVIEW[4C], SoC_Connector[4C], SoC_PWR[7D], SoC_SDIO[5D]), WL_REG_ON (bidir, see OVERVIEW[4C], SoC_SDIO[2D])

### Harnesses
SDIO1: SDC1_D0, SDC1_D1, SDC1_CMD, SDC1_D2, SDC1_D3, SDC1_CLK
UART1: UART1_RX, UART1_RTS, UART1_TX, UART1_CTS
SDIO0: SDC0_CLK, SDC0_CMD, SDC0_D0, SDC0_D3, SDC0_D2, SDC0_D1, SDC0_DET
SDIO2: SDC2_D2, SDC2_D3, SDC2_D1, SDC2_D4, SDC2_D5, SDC2_D0, SDC2_CMD, SDC2_CLK, SDC2_D6, SDC2_D7, SDC2_DS, SDC2_RST

### Nets
GND: C45.2 C46.2 C47.1 C48.1 C49.1 C50.1 C51.1 C52.1 C53.1 C54.1 C55.1 C56.1 C57.1 C58.1 C59.1 C60.1 C61.1 C62.1 C63.2 C64.1 C65.1 C66.1 JP1.2(GND) JP1.3(GND) U6.19(TEN) U6.41(EPAD) U7.6(VSS) U7.10(GND) U7.11(GND) U7.12(GND) U7.13(GND) U8.A6(VSS) U8.C4(VSS) U8.E7(VSS) U8.G5(VSS) U8.H10(VSS) U8.J5(VSS) U8.K8(VSS) U8.N2(VSS) U8.N5(VSS) U8.P4(VSS) U8.P6(VSS) X2.2(GND) X2.4(GND)
VDD_3V3: C49.2 C53.2 C58.2 C59.2 C60.2 C61.2 C64.2 C66.2 R41.1 R43.1 R44.1 R45.1 R46.1 R47.1 R48.1 R49.1 U6.11(VDD_IO) U6.25(LDO_SEL) U6.30(VBAT1) U6.37(VBAT2) U7.4(VDD) U8.C6(VCCQ) U8.E6(VCC) U8.F5(VCC) U8.J10(VCC) U8.K9(VDDF) U8.M4(VCCQ) U8.N4(VCCQ) U8.P3(VCCQ) U8.P5(VCCQ) ; port VDD_3V3
AP_REG_ON: U6.35(WIRQ) ; port AP_REG_ON
BT_RTSN: U6.23(BT_RSTN) ; port BT_RTSN
SDC0_CLK: R50.1 ; port SDIO0.SDC0_CLK
SDC0_CMD: U7.3(CMD(DI)) ; port SDIO0.SDC0_CMD
SDC0_D0: U7.7(DAT0(D0)) ; port SDIO0.SDC0_D0
SDC0_D1: U7.8(DAT1(RSV)) ; port SDIO0.SDC0_D1
SDC0_D2: U7.1(DAT2(RSV)) ; port SDIO0.SDC0_D2
SDC0_D3: U7.2(CDDAT3(CS)) ; port SDIO0.SDC0_D3
SDC0_DET: U7.9(CD) ; port SDIO0.SDC0_DET
SDC1_CLK: U6.16(SDIO_CLK) ; port SDIO1.SDC1_CLK
SDC1_CMD: R45.2 U6.12(SDIO_CMD) ; port SDIO1.SDC1_CMD
SDC1_D0: R46.2 U6.13(SDIO_D0) ; port SDIO1.SDC1_D0
SDC1_D1: R47.2 U6.14(SDIO_D1) ; port SDIO1.SDC1_D1
SDC1_D2: R48.2 U6.17(SDIO_D2) ; port SDIO1.SDC1_D2
SDC1_D3: R49.2 U6.15(SDIO_D3) ; port SDIO1.SDC1_D3
SDC2_CLK: U8.M6(CLK) ; port SDIO2.SDC2_CLK
SDC2_CMD: U8.M5(CMD) ; port SDIO2.SDC2_CMD
SDC2_D0: U8.A3(DAT0) ; port SDIO2.SDC2_D0
SDC2_D1: U8.A4(DAT1) ; port SDIO2.SDC2_D1
SDC2_D2: U8.A5(DAT2) ; port SDIO2.SDC2_D2
SDC2_D3: U8.B2(DAT3) ; port SDIO2.SDC2_D3
SDC2_D4: U8.B3(DAT4) ; port SDIO2.SDC2_D4
SDC2_D5: U8.B4(DAT5) ; port SDIO2.SDC2_D5
SDC2_D6: U8.B5(DAT6) ; port SDIO2.SDC2_D6
SDC2_D7: U8.B6(DAT7) ; port SDIO2.SDC2_D7
SDC2_DS: U8.H5(DataStrobe) ; port SDIO2.SDC2_DS
SDC2_RST: U8.K5(RSTN) ; port SDIO2.SDC2_RST
UART1_CTS: U6.7(UART_RTS) ; port UART1.UART1_CTS
UART1_RTS: U6.8(UART_CTS) ; port UART1.UART1_RTS
UART1_RX: U6.10(UART_TX) ; port UART1.UART1_RX
UART1_TX: U6.9(UART_RX) ; port UART1.UART1_TX
WHXI: C63.1 U6.4(XTAL1) X2.3(OSC2)
WHXO: C65.2 U6.3(XTAL2) X2.1(OSC1)
WL_REG_ON: U6.24(WL_RSTN) ; port WL_REG_ON
NetC45_1: C45.1 R42.1 U6.40(ANT)
NetC46_1: C46.1 JP1.1(SIG) R42.2
NetC47_2: C47.2 C48.2 U8.C2(VDDI)
NetC50_2: C50.2 U6.38(VDD33_PA)
NetC51_2: C51.2 U6.2(VDD12_CLK)
NetC52_2: C52.2 U6.21(VDD12_DIG)
NetC54_2: C54.2 U6.26(VDD_RTC)
NetC55_2: C55.2 C56.2 C57.2 C62.2 U6.1(VDD14_RX) U6.22(VDD14_DIG) U6.28(VDD_SENSE) U6.36(VDD14_TX)
NetR41_2: R41.2 U6.20(LPCLK)
NetR43_2: R43.2 U6.6(BT_WKUP_HOST)
NetR44_2: R44.2 U6.5(BT_HOST_WKUP)
NetR50_2: R50.2 U7.5(CLK(SCLK))

Not connected (* = marked no-connect by the designer): U6 18(CLKREQO)* 27(VDD25_EF)* 29(VDD_VLX) 31(PCM_CLK) 32(PCM_DOUT) 33(PCM_DIN) 34(PCM_SYNC) 39(NC)*; U8 A1(NC) A2(NC) A7(RFU) A8(NC) A9(NC) A10(NC) A11(NC) A12(NC) A13(NC) A14(NC) B1(NC) B7(NC) B8(NC) B9(NC) B10(NC) B11(NC) B12(NC) B13(NC) B14(NC) C1(NC) C3(NC) C5(NC) C7(NC) C8(NC) C9(NC) C10(NC) C11(NC) C12(NC) C13(NC) C14(NC) D1(NC) D2(NC) D3(NC) D4(NC) D12(NC) D13(NC) D14(NC) E1(NC) E2(NC) E3(NC) E5(RFU) E8(RFU) E9(RFU) E10(RFU) E12(NC) E13(NC) E14(NC) F1(NC) F2(NC) F3(NC) F10(RFU) F12(NC) F13(NC) F14(NC) G1(NC) G2(NC) G3(RFU) G10(RFU) G12(NC) G13(NC) G14(NC) H1(NC) H2(NC) H3(NC) H12(NC) H13(NC) H14(NC) J1(NC) J2(NC) J3(NC) J12(NC) J13(NC) J14(NC) K1(NC) K2(NC) K3(NC) K6(RFU) K7(RFU) K10(RFU) K12(NC) K13(NC) K14(NC) L1(NC) L2(NC) L3(NC) L12(NC) L13(NC) L14(NC) M1(NC) M2(NC) M3(NC) M7(NC) M8(NC) M9(NC) M10(NC) M11(NC) M12(NC) M13(NC) M14(NC) N1(NC) N3(NC) N6(NC) N7(NC) N8(NC) N9(NC) N10(NC) N11(NC) N12(NC) N13(NC) N14(NC) P1(NC) P2(NC) P7(RFU) P8(NC) P9(NC) P10(RFU) P11(NC) P12(NC) P13(NC) P14(NC)

### Notes on the sheet
- Wi-Fi
- TF

### Library data of the parts
C45 C46 C64 C66 = 100nF: as C9 on sheet SoC_PWR
C47 C48 C58-C61 = 2.2uF: as C37 on sheet SoC_Connector
C49-C57 C62 = 1uF: as C8 on sheet SoC_PWR
C63 C65 = 22pF: as C36 on sheet SoC_Connector
JP1 = U.FL-R-SMT-1(80)_C88374: Manufacturer: HRS(广濑); Add into BOM: yes; Connector Type: Board Side; Interface: Male Pin; Number of Ports: 1; Interface Diameter: 2mm; Interface Length/Height: 1.25mm; RF Series: IPEX; Impedance: 50Ω; Symbol: U.FL-R-SMT-1(80); Device: U.FL-R-SMT-1(80)_C88374; LCSC Part Name: IPEX 内针; Supplier Part: C88374; Manufacturer Part: U.FL-R-SMT-1(80); Supplier Footprint: SMD; JLCPCB Part Class: Extended Part; Datasheet: https://item.szlcsc.com/datasheet/U.FL-R-SMT-1(80)/89553.html; Supplier: LCSC; Convert to PCB: yes; Value: 6GHz; Style: -; Operating Temperature Range: -40℃~+90℃
R41 R43-R49 = 47kΩ: 62.5mW 47kΩ 50V ±100ppm/℃ Thick Film Resistor ±1% 0402 Chip Resistor - Surface Mount ROHS
R42 = 0Ω: as R32 on sheet SoC_Connector
R50 = 10Ω: 10Ω 62.5mW 50V ±200ppm/℃ Thick Film Resistor ±1% 0402 Chip Resistor - Surface Mount ROHS
U6 = XR829: 2.4GHz WiFi and Bluetooth chips; Symbol: XR829_1
U7 = TF-01A_C91145: Push-Push 1.85mm Connector and Ejector MicroSD Card (TF Card) SMD PC Card Sockets ROHS
U8 = KLM8G1GETF-B041_1: 8GB 2.7V~3.6V eMMC 5.1 330/50 MB/s FBGA-153(11.5x13) Memory (ICs) ROHS; Manufacturer: SAMSUNG(三星半导体); Add into BOM: yes; Reading Speed in Sequence: 330MB/S; Writing Speed in Sequence: 50MB/S; Controller Operating Voltage (VCCQ): 2.7V~3.6V；1.7V~1.95V; Symbol: KLM8G1GETF-B041; Device: KLM8G1GETF-B041; LCSC Part Name: KLM8G1GETF-B041; Supplier Part: C499918; Manufacturer Part: KLM8G1GETF-B041; Supplier Footprint: FBGA-153(11.5x13); JLCPCB Part Class: Extended Part; Datasheet: https://item.szlcsc.com/datasheet/KLM8G1GETF-B041/512098.html; Supplier: LCSC; Convert to PCB: yes; configuration: -; Interface: eMMC 5.1; Voltage - Supply: 2.7V~3.6V; Operating Temperature: -25℃~+85℃; Sequential Read/Write (MB/s): 330/50 MB/s; Random Read/Write (IOPS): -; Memory Size: 8GB; NAND Operating Voltage (VCCF): 2.7V~3.6V
X2 = X322540MPB4SI: Crystal Oscillator 15pF SMD3225-4P Crystals ROHS

## Nets that join several sheets
GND: SoC_DDR (47 pins), SoC_PWR (96 pins), SoC_Connector (48 pins), SoC_SDIO (R38.2), WiFi_TF_EMMC (44 pins)
VCC_5V: SoC_PWR (7 pins), SoC_Connector (5 pins)
VCC_DRAM: SoC_DDR (41 pins), SoC_PWR (14 pins)
VDD_1V8: SoC_DDR (*1.L14), SoC_PWR (8 pins), SoC_Connector (6 pins)
VDD_3V3: SoC_PWR (7 pins), SoC_Connector (*1.E18 *1.M18 D5.2), SoC_SDIO (*3.D7 *3.F5 *3.J6), WiFi_TF_EMMC (30 pins)
AP_REG_ON: SoC_SDIO (*3.C9), WiFi_TF_EMMC (U6.35)
BT_RTSN: SoC_SDIO (*3.C10), WiFi_TF_EMMC (U6.23)
D0_N: SoC_PWR (USB1.5 USB1.7), SoC_Connector (R24.2)
D0_P: SoC_PWR (USB1.6 USB1.8), SoC_Connector (R23.2)
PMU_IRQ: SoC_PWR (*2.11 R13.1), SoC_SDIO (*3.C1)
PMU_SCK: SoC_PWR (*2.6 R11.1), SoC_SDIO (*3.C18)
PMU_SDA: SoC_PWR (*2.5 R10.1), SoC_SDIO (*3.B18)
RESET: SoC_PWR (*2.13), SoC_Connector (*1.A16)
SDC0_CLK: SoC_SDIO (*3.K1), WiFi_TF_EMMC (R50.1)
SDC0_CMD: SoC_SDIO (*3.K3), WiFi_TF_EMMC (U7.3)
SDC0_D0: SoC_SDIO (*3.J3), WiFi_TF_EMMC (U7.7)
SDC0_D1: SoC_SDIO (*3.J2), WiFi_TF_EMMC (U7.8)
SDC0_D2: SoC_SDIO (*3.L3), WiFi_TF_EMMC (U7.1)
SDC0_D3: SoC_SDIO (*3.L2), WiFi_TF_EMMC (U7.2)
SDC0_DET: SoC_SDIO (*3.K2), WiFi_TF_EMMC (U7.9)
SDC1_CLK: SoC_SDIO (R40.1), WiFi_TF_EMMC (U6.16)
SDC1_CMD: SoC_SDIO (*3.C7), WiFi_TF_EMMC (R45.2 U6.12)
SDC1_D0: SoC_SDIO (*3.C6), WiFi_TF_EMMC (R46.2 U6.13)
SDC1_D1: SoC_SDIO (*3.B5), WiFi_TF_EMMC (R47.2 U6.14)
SDC1_D2: SoC_SDIO (*3.C5), WiFi_TF_EMMC (R48.2 U6.17)
SDC1_D3: SoC_SDIO (*3.B7), WiFi_TF_EMMC (R49.2 U6.15)
SDC2_CLK: SoC_SDIO (R39.1), WiFi_TF_EMMC (U8.M6)
SDC2_CMD: SoC_SDIO (*3.E2), WiFi_TF_EMMC (U8.M5)
SDC2_D0: SoC_SDIO (*3.F2), WiFi_TF_EMMC (U8.A3)
SDC2_D1: SoC_SDIO (*3.G3), WiFi_TF_EMMC (U8.A4)
SDC2_D2: SoC_SDIO (*3.H2), WiFi_TF_EMMC (U8.A5)
SDC2_D3: SoC_SDIO (*3.E3), WiFi_TF_EMMC (U8.B2)
SDC2_D4: SoC_SDIO (*3.F1), WiFi_TF_EMMC (U8.B3)
SDC2_D5: SoC_SDIO (*3.F3), WiFi_TF_EMMC (U8.B4)
SDC2_D6: SoC_SDIO (*3.H1), WiFi_TF_EMMC (U8.B5)
SDC2_D7: SoC_SDIO (*3.H3), WiFi_TF_EMMC (U8.B6)
SDC2_DS: SoC_SDIO (*3.B1), WiFi_TF_EMMC (U8.H5)
SDC2_RST: SoC_SDIO (*3.C2), WiFi_TF_EMMC (U8.K5)
UART1_CTS: SoC_SDIO (*3.B3), WiFi_TF_EMMC (U6.7)
UART1_RTS: SoC_SDIO (*3.C4), WiFi_TF_EMMC (U6.8)
UART1_RX: SoC_SDIO (*3.B4), WiFi_TF_EMMC (U6.10)
UART1_TX: SoC_SDIO (*3.A4), WiFi_TF_EMMC (U6.9)
WL_REG_ON: SoC_SDIO (*3.B10), WiFi_TF_EMMC (U6.24)